# EAGLE schematic obc (EAGLE 9.4.2)

## Sheet 1 of 8: MCU
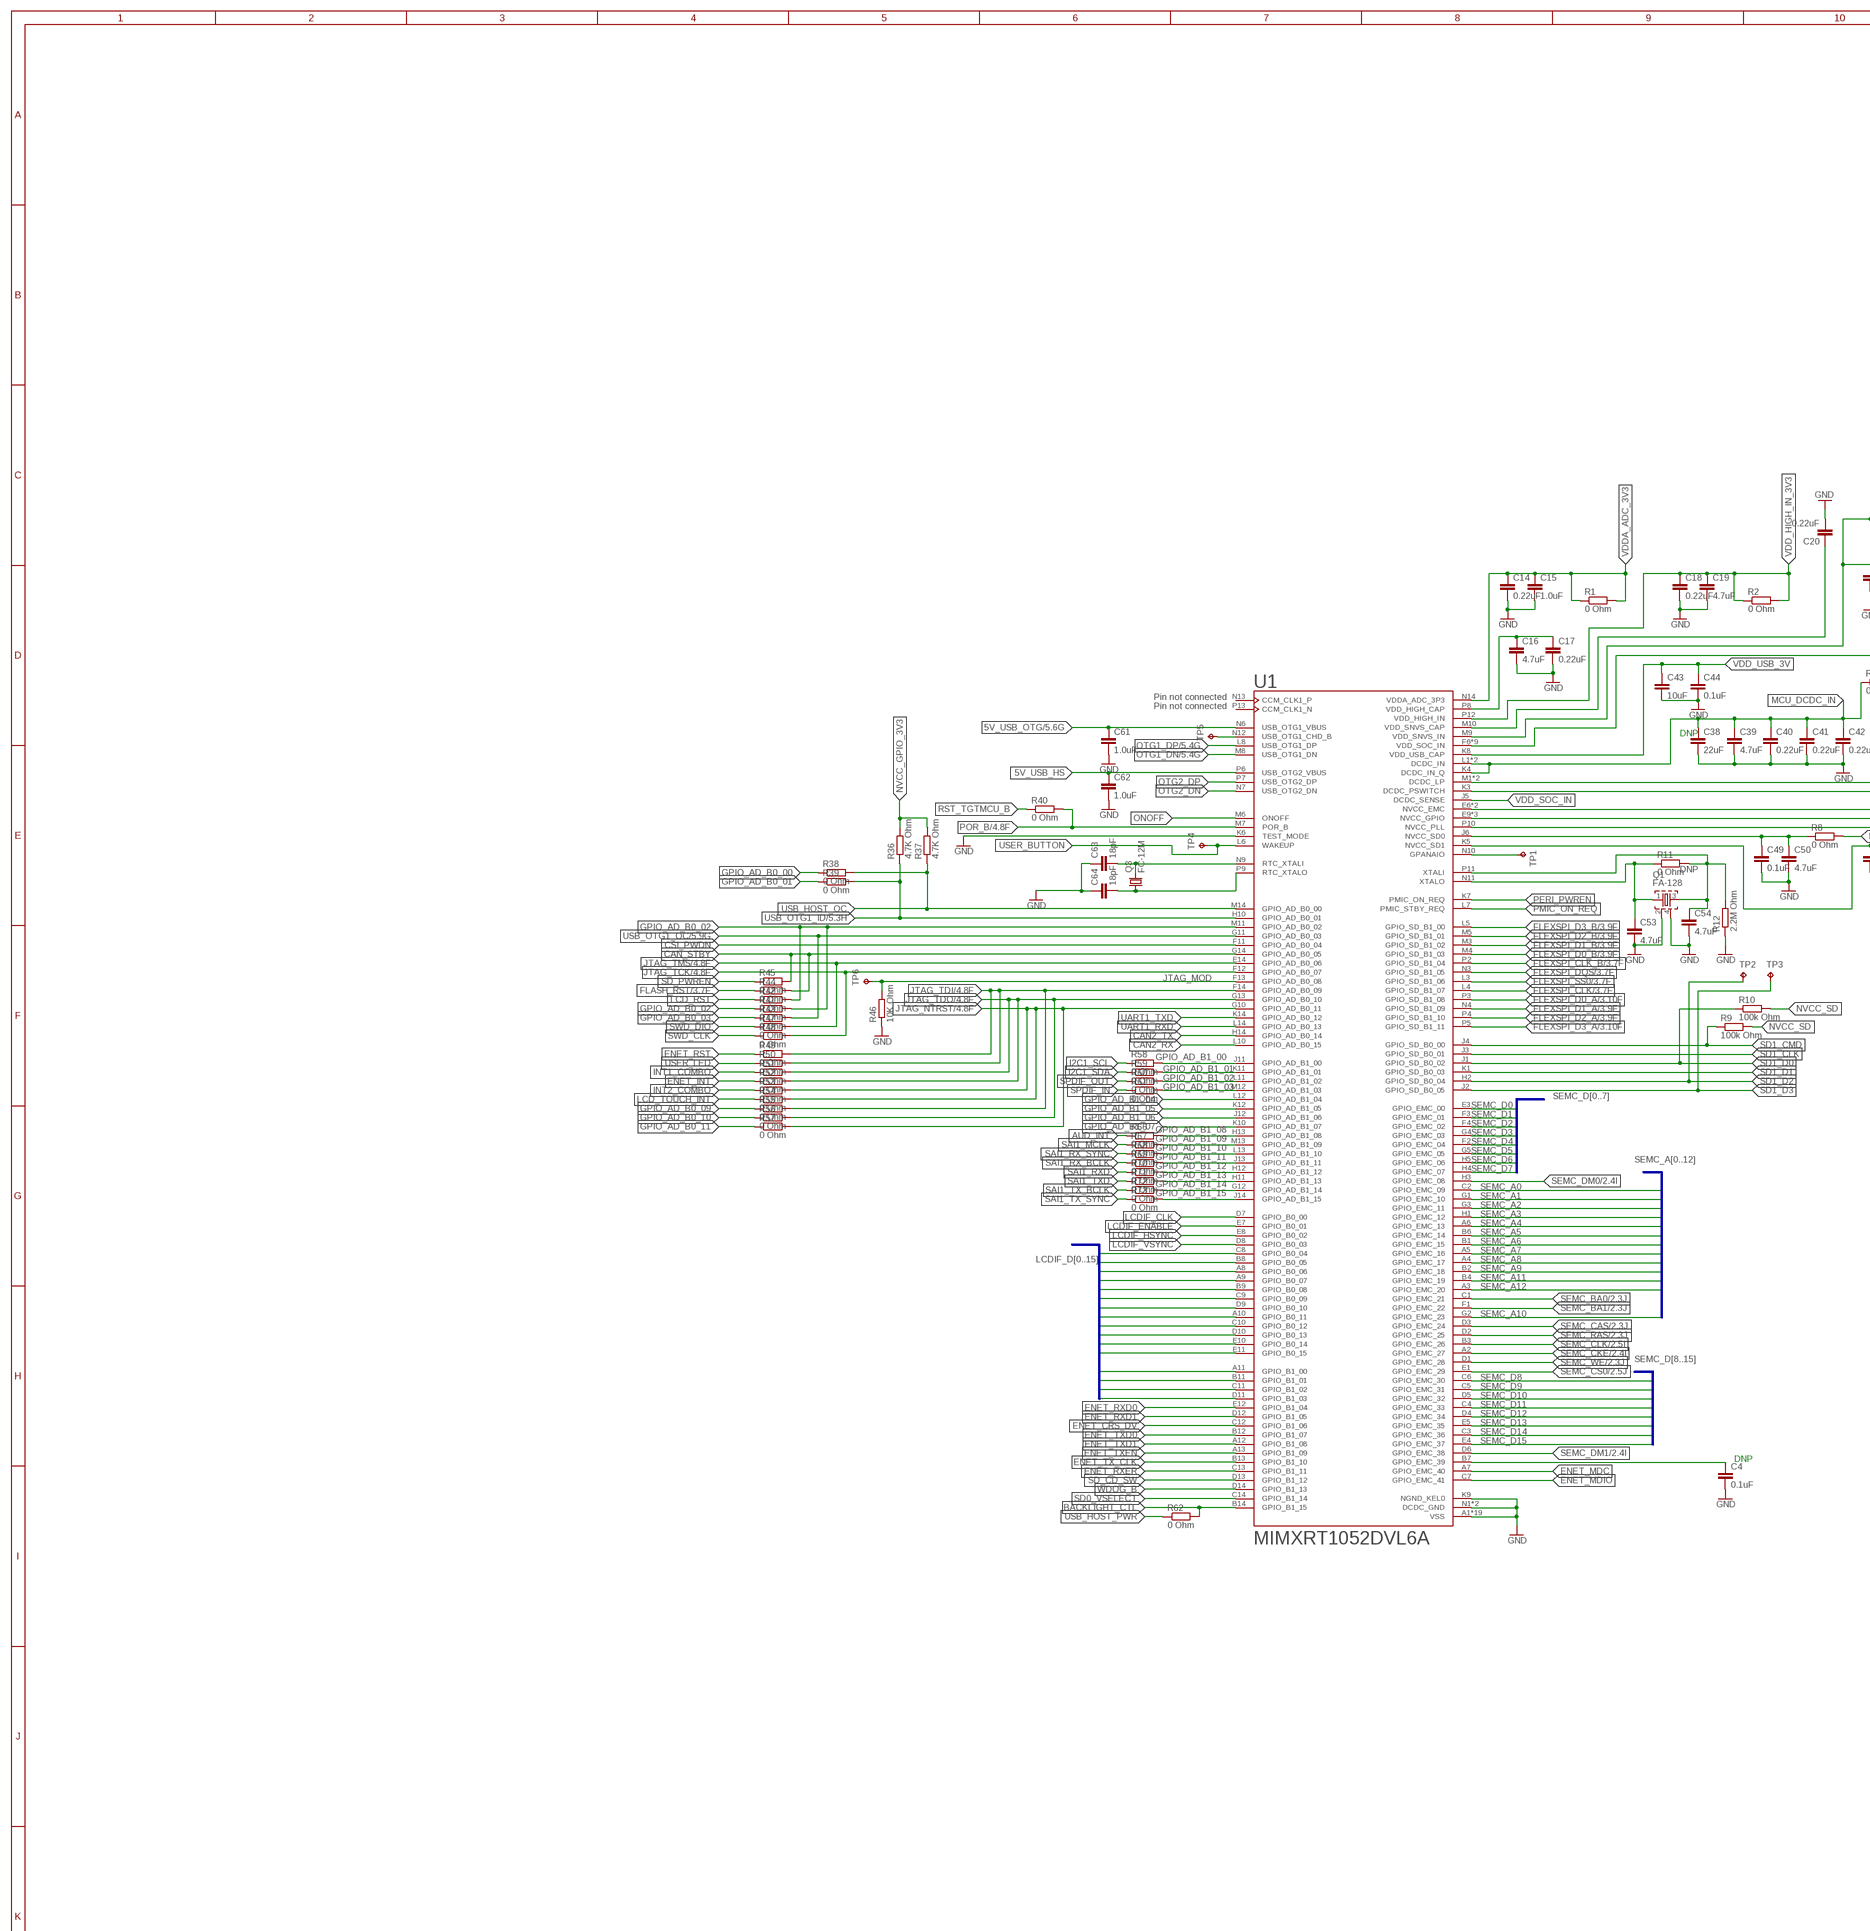
[diagram p0: schematic, sheet 1, part 1 of 3]
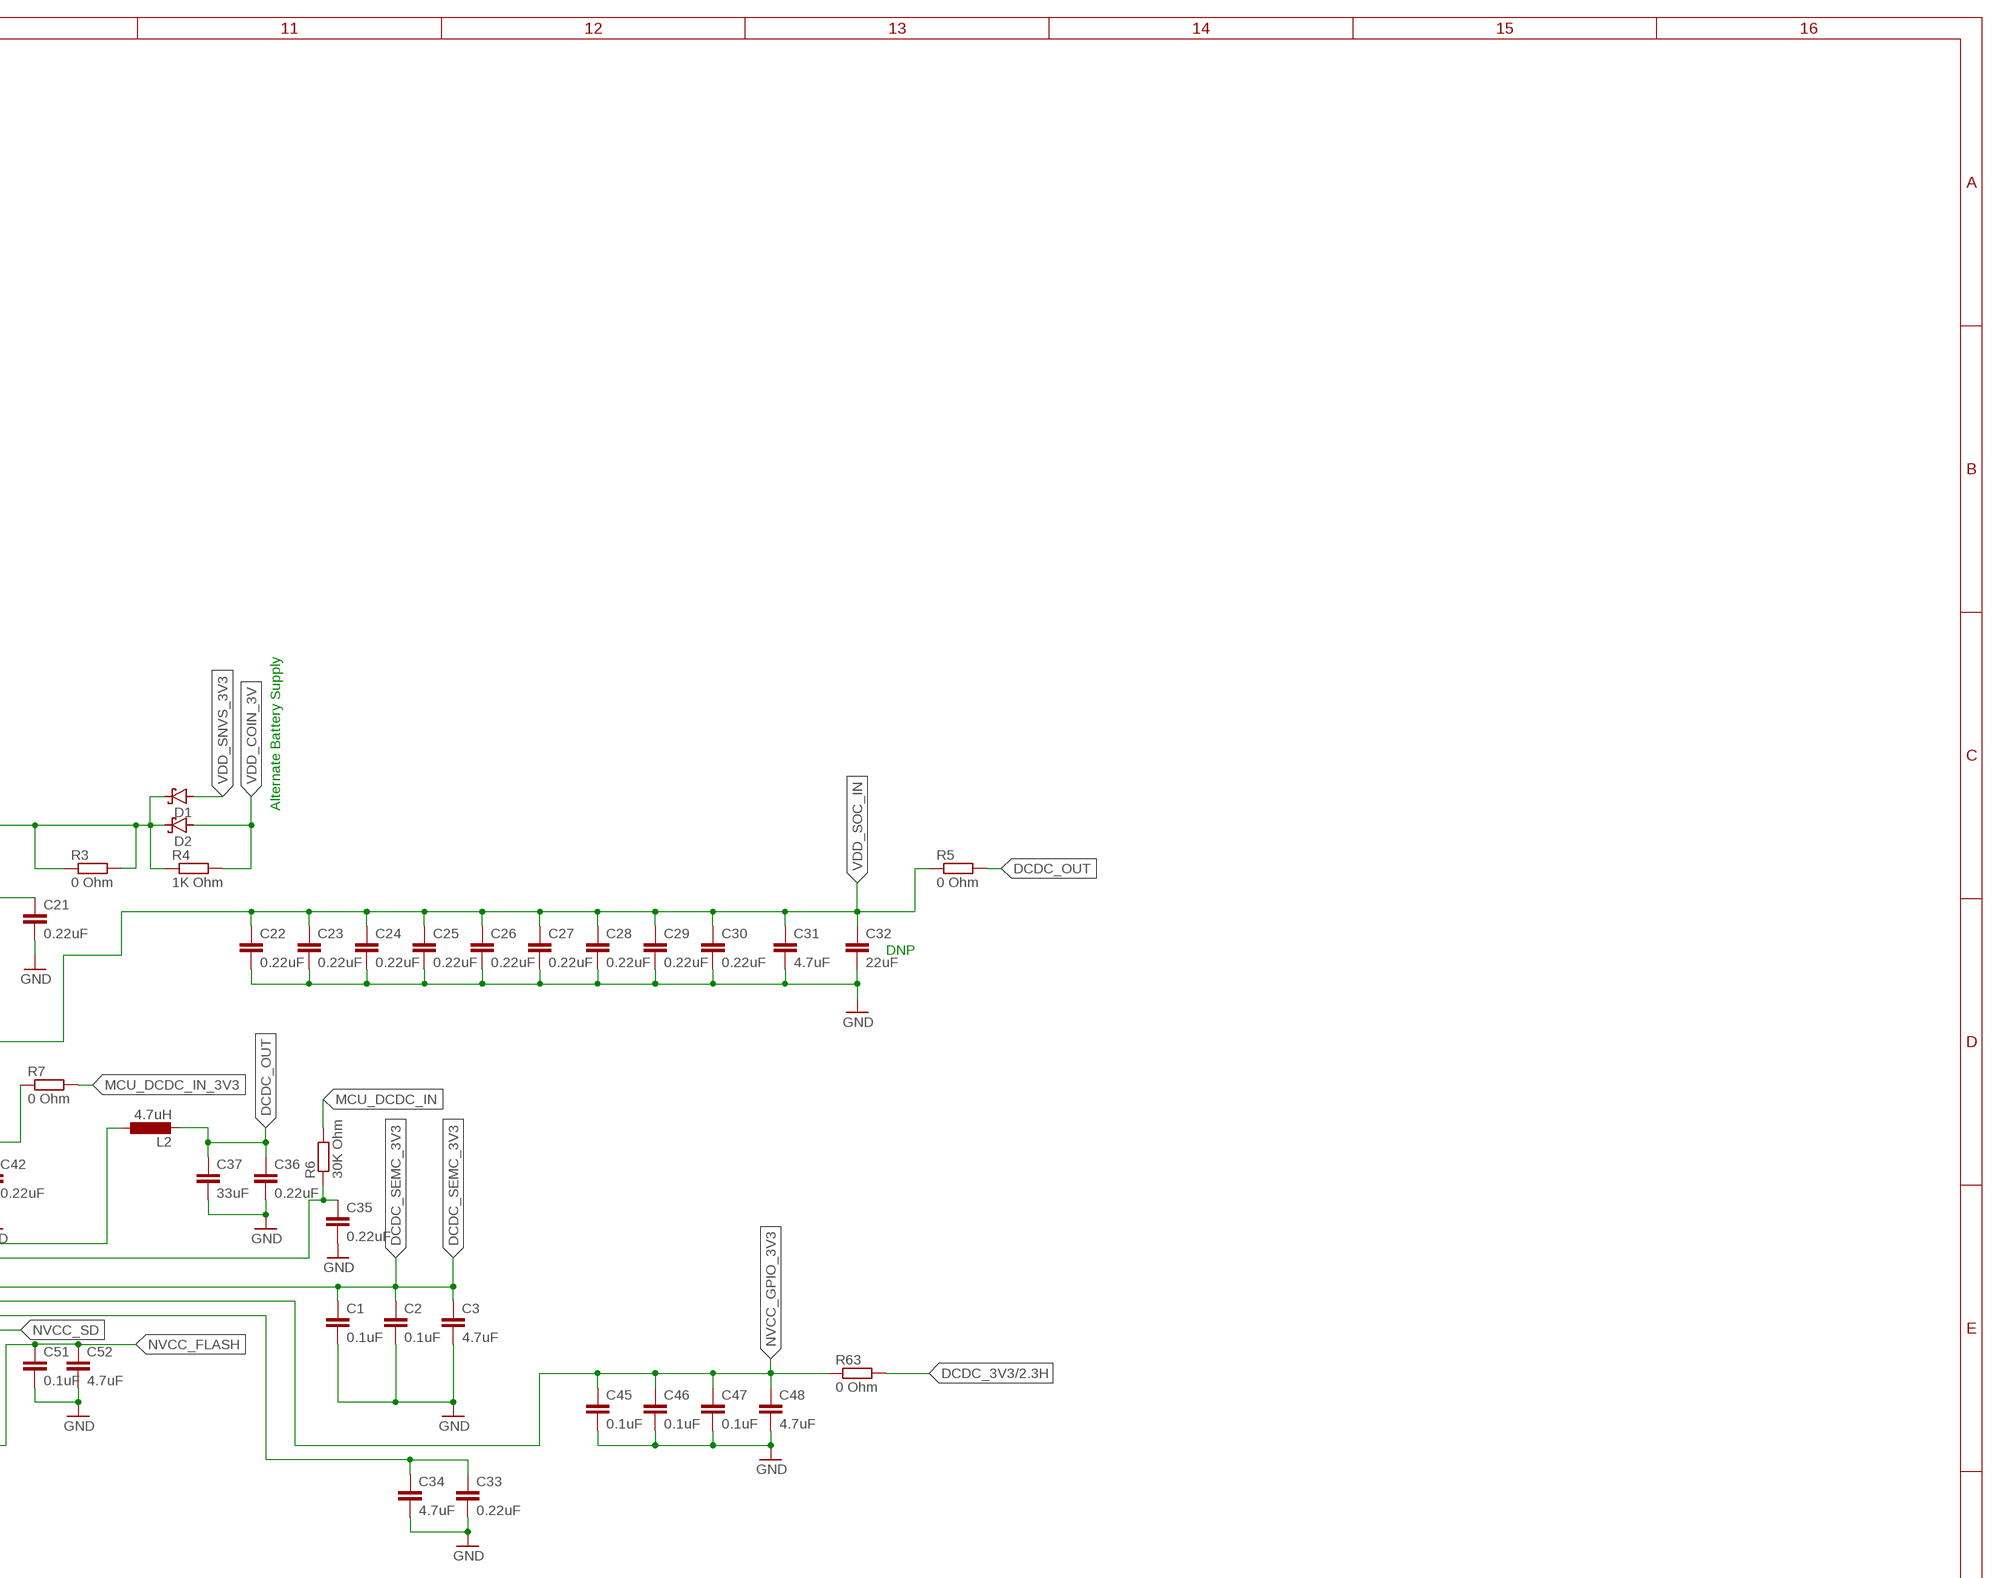
[diagram p1: schematic, sheet 1, part 2 of 3]
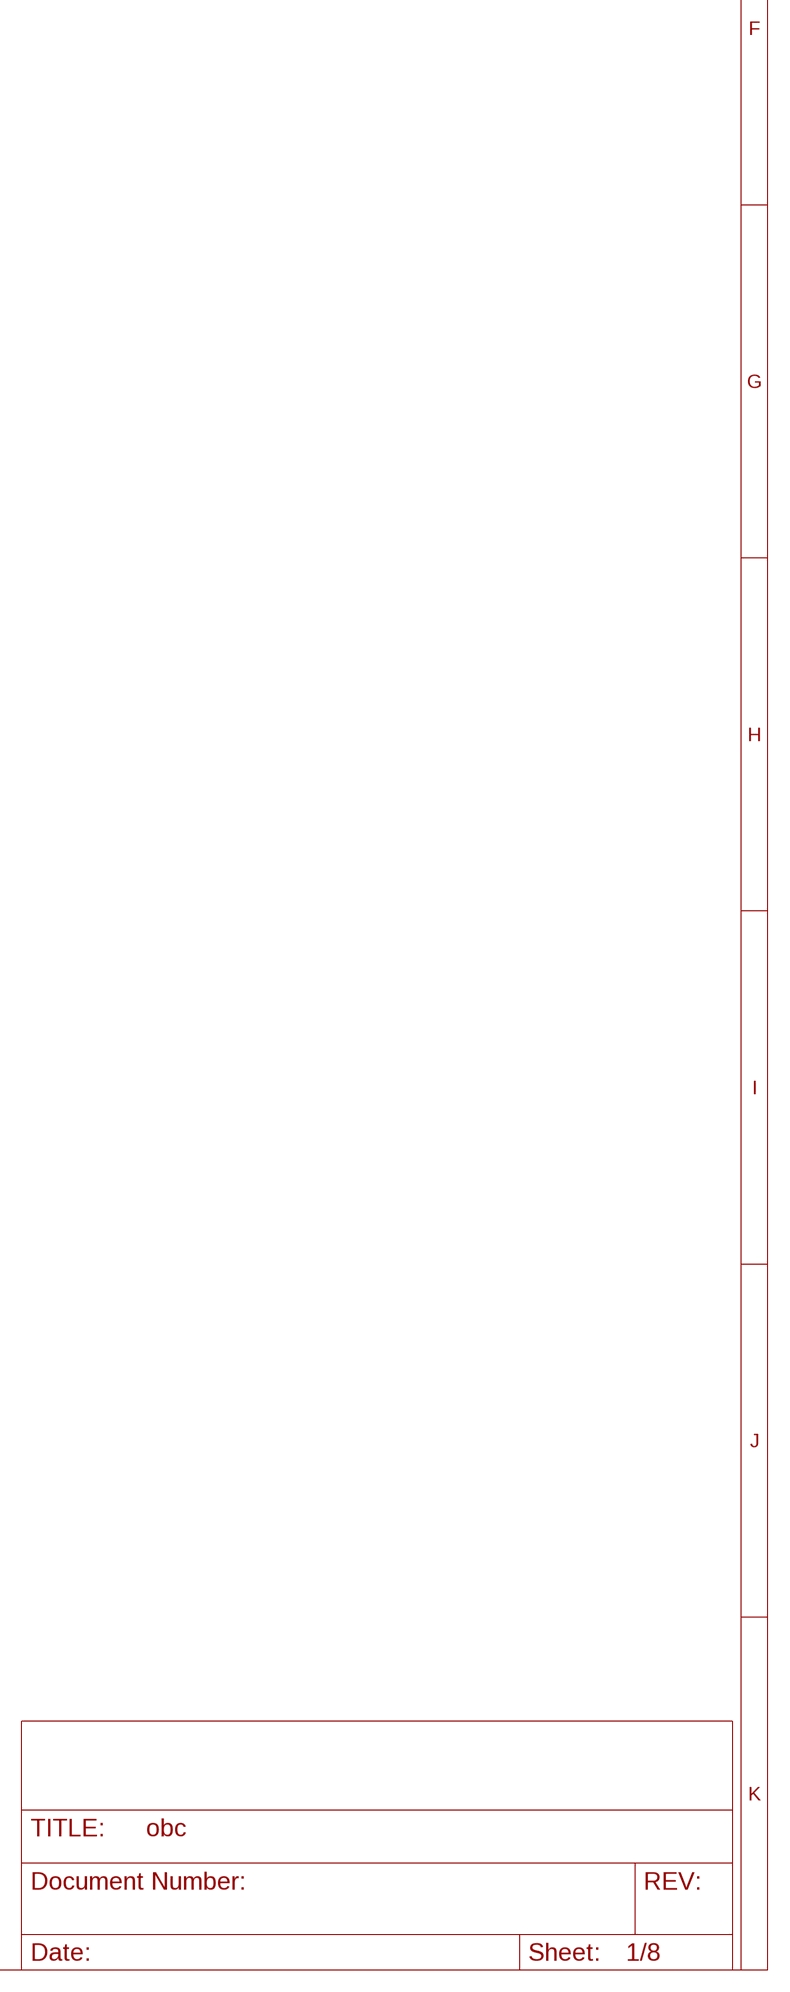
[diagram p2: schematic, sheet 1, part 3 of 3]

### Parts
C1  0.1uF  C-EUC0402K  [C0402K]
C2  0.1uF  C-EUC0402K  [C0402K]
C3  4.7uF  C-EUC0402K  [C0402K]
C4  0.1uF  C-EUC0402K  [C0402K]
C14  0.22uF  C-EUC0402K  [C0402K]
C15  1.0uF  C-EUC0402K  [C0402K]
C16  4.7uF  C-EUC0402K  [C0402K]
C17  0.22uF  C-EUC0402K  [C0402K]
C18  0.22uF  C-EUC0402K  [C0402K]
C19  4.7uF  C-EUC0402K  [C0402K]
C20  0.22uF  C-EUC0402K  [C0402K]
C21  0.22uF  C-EUC0402K  [C0402K]
C22  0.22uF  C-EUC0402K  [C0402K]
C23  0.22uF  C-EUC0402K  [C0402K]
C24  0.22uF  C-EUC0402K  [C0402K]
C25  0.22uF  C-EUC0402K  [C0402K]
C26  0.22uF  C-EUC0402K  [C0402K]
C27  0.22uF  C-EUC0402K  [C0402K]
C28  0.22uF  C-EUC0402K  [C0402K]
C29  0.22uF  C-EUC0402K  [C0402K]
C30  0.22uF  C-EUC0402K  [C0402K]
C31  4.7uF  C-EUC0402K  [C0402K]
C32  22uF  C-EUC0603K  [C0603K]
C33  0.22uF  C-EUC0402K  [C0402K]
C34  4.7uF  C-EUC0402K  [C0402K]
C35  0.22uF  C-EUC0402K  [C0402K]
C36  0.22uF  C-EUC0402K  [C0402K]
C37  33uF  C-EUC0402K  [C0402K]
C38  22uF  C-EUC0402K  [C0402K]
C39  4.7uF  C-EUC0402K  [C0402K]
C40  0.22uF  C-EUC0402K  [C0402K]
C41  0.22uF  C-EUC0402K  [C0402K]
C42  0.22uF  C-EUC0402K  [C0402K]
C43  10uF  C-EUC0402K  [C0402K]
C44  0.1uF  C-EUC0402K  [C0402K]
C45  0.1uF  C-EUC0402K  [C0402K]
C46  0.1uF  C-EUC0402K  [C0402K]
C47  0.1uF  C-EUC0402K  [C0402K]
C48  4.7uF  C-EUC0402K  [C0402K]
C49  0.1uF  C-EUC0402K  [C0402K]
C50  4.7uF  C-EUC0402K  [C0402K]
C51  0.1uF  C-EUC0402K  [C0402K]
C52  4.7uF  C-EUC0402K  [C0402K]
C53  4.7uF  C-EUC0402K  [C0402K]
C54  4.7uF  C-EUC0402K  [C0402K]
C61  1.0uF  C-EUC0402K  [C0402K]
C62  1.0uF  C-EUC0402K  [C0402K]
C63  18pF  C-EUC0402K  [C0402K]
C64  18pF  C-EUC0402K  [C0402K]
D1  SCHOTTKY-DIODESMC  [SMC]
D2  SCHOTTKY-DIODESMC  [SMC]
L2  4.7uH  L-EUL4035M  [L4035M]
Q1  FA-128  [FA-128]
Q3  FC-12M  [FC-12M]
R1  0 Ohm  R-EU_R0402  [R0402]
R2  0 Ohm  R-EU_R0402  [R0402]
R3  0 Ohm  R-EU_R0402  [R0402]
R4  1K Ohm  R-EU_R0402  [R0402]
R5  0 Ohm  R-EU_R0402  [R0402]
R6  30K Ohm  R-EU_R0402  [R0402]
R7  0 Ohm  R-EU_R0402  [R0402]
R8  0 Ohm  R-EU_R0402  [R0402]
R9  100k Ohm  R-EU_R0402  [R0402]
R10  100k Ohm  R-EU_R0402  [R0402]
R11  0 Ohm  R-EU_R0402  [R0402]
R12  2.2M Ohm  R-EU_R0402  [R0402]
R36  4.7K Ohm  R-EU_R0402  [R0402]
R37  4.7K Ohm  R-EU_R0402  [R0402]
R38  0 Ohm  R-EU_R0402  [R0402]
R39  0 Ohm  R-EU_R0402  [R0402]
R40  0 Ohm  R-EU_R0402  [R0402]
R41  0 Ohm  R-EU_R0402  [R0402]
R42  0 Ohm  R-EU_R0402  [R0402]
R43  0 Ohm  R-EU_R0402  [R0402]
R44  0 Ohm  R-EU_R0402  [R0402]
R45  0 Ohm  R-EU_R0402  [R0402]
R46  10K Ohm  R-EU_R0402  [R0402]
R47  0 Ohm  R-EU_R0402  [R0402]
R48  0 Ohm  R-EU_R0402  [R0402]
R49  0 Ohm  R-EU_R0402  [R0402]
R50  0 Ohm  R-EU_R0402  [R0402]
R51  0 Ohm  R-EU_R0402  [R0402]
R52  0 Ohm  R-EU_R0402  [R0402]
R53  0 Ohm  R-EU_R0402  [R0402]
R54  0 Ohm  R-EU_R0402  [R0402]
R55  0 Ohm  R-EU_R0402  [R0402]
R56  0 Ohm  R-EU_R0402  [R0402]
R57  0 Ohm  R-EU_R0402  [R0402]
R58  0 Ohm  R-EU_R0402  [R0402]
R59  0 Ohm  R-EU_R0402  [R0402]
R60  0 Ohm  R-EU_R0402  [R0402]
R61  0 Ohm  R-EU_R0402  [R0402]
R62  0 Ohm  R-EU_R0402  [R0402]
R63  0 Ohm  R-EU_R0402  [R0402]
R66  0 Ohm  R-EU_R0402  [R0402]
R67  0 Ohm  R-EU_R0402  [R0402]
R68  0 Ohm  R-EU_R0402  [R0402]
R69  0 Ohm  R-EU_R0402  [R0402]
R70  0 Ohm  R-EU_R0402  [R0402]
R71  0 Ohm  R-EU_R0402  [R0402]
R72  0 Ohm  R-EU_R0402  [R0402]
R73  0 Ohm  R-EU_R0402  [R0402]
TP1  TPTP06R  [TP06R]
TP2  TPTP06R  [TP06R]
TP3  TPTP06R  [TP06R]
TP4  TPTP06R  [TP06R]
TP5  TPTP06R  [TP06R]
TP6  TPTP06R  [TP06R]
U1  MIMXRT1052DVL6A  [BGA196C65P14X14_1000X1000X152N]

### Nets
5V_USB_HS: C62.1 U1.P6(USB_OTG2_VBUS)
5V_USB_OTG: C61.1 U1.N6(USB_OTG1_VBUS) ; also sheet 5
AUD_INT: R66.1
BACKLIGHT_CTL: R62.2 U1.B14(GPIO_B1_15)
CAN2_RX: U1.L10(GPIO_AD_B0_15)
CAN2_TX: U1.H14(GPIO_AD_B0_14)
CAN_STBY: R44.2 R45.2 U1.G14(GPIO_AD_B0_05)
CSI_PWDN: U1.F11(GPIO_AD_B0_04)
DCDC_3V3: R63.2 ; also sheet 2,4,5
DCDC_OUT: C36.1 C37.1 L2.2 R5.2
DCDC_SEMC_3V3: C1.1 C2.1 C3.1 U1.E6(NVCC_EMC) U1.F5(NVCC_EMC)
ENET_CRS_DV: U1.C12(GPIO_B1_06)
ENET_INT: R52.1
ENET_MDC: U1.A7(GPIO_EMC_40)
ENET_MDIO: U1.C7(GPIO_EMC_41)
ENET_RST: R49.1
ENET_RXD0: U1.E12(GPIO_B1_04)
ENET_RXD1: U1.D12(GPIO_B1_05)
ENET_RXER: U1.C13(GPIO_B1_11)
ENET_TX_CLK: U1.B13(GPIO_B1_10)
ENET_TXD0: U1.B12(GPIO_B1_07)
ENET_TXD1: U1.A12(GPIO_B1_08)
ENET_TXEN: U1.A13(GPIO_B1_09)
FLASH_RST: R44.1 ; also sheet 3
FLEXSPI_CLK: U1.L4(GPIO_SD_B1_07) ; also sheet 3
FLEXSPI_CLK_B: U1.P2(GPIO_SD_B1_04) ; also sheet 3
FLEXSPI_D0_A: U1.P3(GPIO_SD_B1_08) ; also sheet 3
FLEXSPI_D0_B: U1.M4(GPIO_SD_B1_03) ; also sheet 3
FLEXSPI_D1_A: U1.N4(GPIO_SD_B1_09) ; also sheet 3
FLEXSPI_D1_B: U1.M3(GPIO_SD_B1_02) ; also sheet 3
FLEXSPI_D2_A: U1.P4(GPIO_SD_B1_10) ; also sheet 3
FLEXSPI_D2_B: U1.M5(GPIO_SD_B1_01) ; also sheet 3
FLEXSPI_D3_A: U1.P5(GPIO_SD_B1_11) ; also sheet 3
FLEXSPI_D3_B: U1.L5(GPIO_SD_B1_00) ; also sheet 3
FLEXSPI_DQS: U1.N3(GPIO_SD_B1_05) ; also sheet 3
FLEXSPI_SS0: U1.L3(GPIO_SD_B1_06) ; also sheet 3
GND: C1.2 C2.2 C3.2 C4.2 C14.2 C15.2 C16.2 C17.2 C18.2 C19.2 C20.2 C21.2 C22.2 C23.2 C24.2 C25.2 C26.2 C27.2 C28.2 C29.2 C30.2 C31.2 C32.2 C33.2 C34.2 C35.2 C36.2 C37.2 C38.2 C39.2 C40.2 C41.2 C42.2 C43.2 C44.2 C45.2 C46.2 C47.2 C48.2 C49.2 C50.2 C51.2 C52.2 C53.2 C54.2 C61.2 C62.2 C63.1 C64.1 Q1.2 Q1.4 R12.1 R46.1 U1.A1(VSS) U1.A14(VSS) U1.B5(VSS) U1.B10(VSS) U1.E2(VSS) U1.E13(VSS) U1.G7(VSS) U1.G8(VSS) U1.H7(VSS) U1.H8(VSS) U1.J7(VSS) U1.J8(VSS) U1.K2(VSS) U1.K6(TEST_MODE) U1.K9(NGND_KEL0) U1.K13(VSS) U1.L9(VSS) U1.N1(DCDC_GND) U1.N2(DCDC_GND) U1.N5(VSS) U1.N8(VSS) U1.P1(VSS) U1.P14(VSS) ; also sheet 2,3,4,5,6
GPIO_AD_B0_00: R38.1
GPIO_AD_B0_01: R39.1
GPIO_AD_B0_02: R41.1 R41.2 R42.2 U1.M11(GPIO_AD_B0_02)
GPIO_AD_B0_03: R43.1
GPIO_AD_B0_09: R55.1
GPIO_AD_B0_10: R56.1
GPIO_AD_B0_11: R57.1
GPIO_AD_B1_00: R58.2 U1.J11(GPIO_AD_B1_00)
GPIO_AD_B1_01: R59.2 U1.K11(GPIO_AD_B1_01)
GPIO_AD_B1_02: R60.2 U1.L11(GPIO_AD_B1_02)
GPIO_AD_B1_03: R61.2 U1.M12(GPIO_AD_B1_03)
GPIO_AD_B1_04: U1.L12(GPIO_AD_B1_04)
GPIO_AD_B1_05: U1.K12(GPIO_AD_B1_05)
GPIO_AD_B1_06: U1.J12(GPIO_AD_B1_06)
GPIO_AD_B1_07: U1.K10(GPIO_AD_B1_07)
GPIO_AD_B1_08: R66.2 U1.H13(GPIO_AD_B1_08)
GPIO_AD_B1_09: R67.2 U1.M13(GPIO_AD_B1_09)
GPIO_AD_B1_10: R68.2 U1.L13(GPIO_AD_B1_10)
GPIO_AD_B1_11: R69.2 U1.J13(GPIO_AD_B1_11)
GPIO_AD_B1_12: R70.2 U1.H12(GPIO_AD_B1_12)
GPIO_AD_B1_13: R71.2 U1.H11(GPIO_AD_B1_13)
GPIO_AD_B1_14: R72.2 U1.G12(GPIO_AD_B1_14)
GPIO_AD_B1_15: R73.2 U1.J14(GPIO_AD_B1_15)
I2C1_SCL: R58.1
I2C1_SDA: R59.1
INT1_COMBO: R51.1
INT2_COMBO: R53.1
JTAG_MOD: R46.2 TP6.TP U1.F13(GPIO_AD_B0_08)
JTAG_NTRST: R53.2 R54.2 R57.2 U1.G10(GPIO_AD_B0_11) ; also sheet 4
JTAG_TCK: R48.2 U1.F12(GPIO_AD_B0_07) ; also sheet 4
JTAG_TDI: R49.2 R50.2 R55.2 U1.F14(GPIO_AD_B0_09) ; also sheet 4
JTAG_TDO: R51.2 R52.2 R56.2 U1.G13(GPIO_AD_B0_10) ; also sheet 4
JTAG_TMS: R47.2 U1.E14(GPIO_AD_B0_06) ; also sheet 4
LCD_RST: R42.1
LCD_TOUCH_INT: R54.1
LCDIF_CLK: U1.D7(GPIO_B0_00)
LCDIF_D0: U1.C8(GPIO_B0_04)
LCDIF_D1: U1.B8(GPIO_B0_05)
LCDIF_D2: U1.A8(GPIO_B0_06)
LCDIF_D3: U1.A9(GPIO_B0_07)
LCDIF_D4: U1.B9(GPIO_B0_08)
LCDIF_D5: U1.C9(GPIO_B0_09)
LCDIF_D6: U1.D9(GPIO_B0_10)
LCDIF_D7: U1.A10(GPIO_B0_11)
LCDIF_D8: U1.C10(GPIO_B0_12)
LCDIF_D9: U1.D10(GPIO_B0_13)
LCDIF_D10: U1.E10(GPIO_B0_14)
LCDIF_D11: U1.E11(GPIO_B0_15)
LCDIF_D12: U1.A11(GPIO_B1_00)
LCDIF_D13: U1.B11(GPIO_B1_01)
LCDIF_D14: U1.C11(GPIO_B1_02)
LCDIF_D15: U1.D11(GPIO_B1_03)
LCDIF_ENABLE: U1.E7(GPIO_B0_01)
LCDIF_HSYNC: U1.E8(GPIO_B0_02)
LCDIF_VSYNC: U1.D8(GPIO_B0_03)
MCU_DCDC_IN: C38.1 C39.1 C40.1 C41.1 C42.1 R6.2 R7.1 U1.K4(DCDC_IN_Q) U1.L1(DCDC_IN) U1.L2(DCDC_IN)
MCU_DCDC_IN_3V3: R7.2
N$1: C4.1 U1.B7(GPIO_EMC_39)
N$2: C16.1 C17.1 U1.P8(VDD_HIGH_CAP)
N$3: C20.1 U1.M10(VDD_SNVS_CAP)
N$4: C35.1 R6.1 U1.K3(DCDC_PSWITCH)
N$5: C21.1 D1.C D2.C R3.1 R3.2 R4.1 U1.M9(VDD_SNVS_IN)
N$6: L2.1 U1.M1(DCDC_LP) U1.M2(DCDC_LP)
N$7: C33.1 C34.1 U1.P10(NVCC_PLL)
N$8: C49.1 C50.1 R8.1 U1.J6(NVCC_SD0)
N$9: TP1.TP U1.N10(GPANAIO)
N$10: C54.1 Q1.3 R11.2 R12.2 U1.P11(XTALI)
N$11: C53.1 Q1.1 R11.1 U1.N11(XTALO)
N$52: TP5.TP U1.N12(USB_OTG1_CHD_B)
N$53: C63.2 Q3.2 U1.N9(RTC_XTALI)
N$55: C64.2 Q3.1 U1.P9(RTC_XTALO)
NVCC_FLASH: C51.1 C52.1 U1.K5(NVCC_SD1)
NVCC_GPIO_3V3: C45.1 C46.1 C47.1 C48.1 R36.2 R37.2 R63.1 U1.E9(NVCC_GPIO) U1.F10(NVCC_GPIO) U1.J10(NVCC_GPIO)
NVCC_SD: R8.2 R9.2 R10.2
ONOFF: U1.M6(ONOFF)
OTG1_DN: U1.M8(USB_OTG1_DN) ; also sheet 5
OTG1_DP: U1.L8(USB_OTG1_DP) ; also sheet 5
OTG2_DN: U1.N7(USB_OTG2_DN)
OTG2_DP: U1.P7(USB_OTG2_DP)
PERI_PWREN: U1.K7(PMIC_ON_REQ)
PMIC_ON_REQ: U1.L7(PMIC_STBY_REQ)
POR_B: R40.2 U1.M7(POR_B) ; also sheet 4
RST_TGTMCU_B: R40.1
SAI1_MCLK: R67.1
SAI1_RX_BCLK: R69.1
SAI1_RX_SYNC: R68.1
SAI1_RXD: R70.1
SAI1_TX_BCLK: R72.1
SAI1_TX_SYNC: R73.1
SAI1_TXD: R71.1
SD0_VSELECT: U1.C14(GPIO_B1_14)
SD1_CLK: U1.J3(GPIO_SD_B0_01)
SD1_CMD: R9.1 U1.J4(GPIO_SD_B0_00)
SD1_D0: R10.1 U1.J1(GPIO_SD_B0_02)
SD1_D1: U1.K1(GPIO_SD_B0_03)
SD1_D2: TP2.TP U1.H2(GPIO_SD_B0_04)
SD1_D3: TP3.TP U1.J2(GPIO_SD_B0_05)
SD_CD_SW: U1.D13(GPIO_B1_12)
SD_PWREN: R45.1
SEMC_A0: U1.C2(GPIO_EMC_09) ; also sheet 2
SEMC_A1: U1.G1(GPIO_EMC_10) ; also sheet 2
SEMC_A2: U1.G3(GPIO_EMC_11) ; also sheet 2
SEMC_A3: U1.H1(GPIO_EMC_12) ; also sheet 2
SEMC_A4: U1.A6(GPIO_EMC_13) ; also sheet 2
SEMC_A5: U1.B6(GPIO_EMC_14) ; also sheet 2
SEMC_A6: U1.B1(GPIO_EMC_15) ; also sheet 2
SEMC_A7: U1.A5(GPIO_EMC_16) ; also sheet 2
SEMC_A8: U1.A4(GPIO_EMC_17) ; also sheet 2
SEMC_A9: U1.B2(GPIO_EMC_18) ; also sheet 2
SEMC_A10: U1.G2(GPIO_EMC_23) ; also sheet 2
SEMC_A11: U1.B4(GPIO_EMC_19) ; also sheet 2
SEMC_A12: U1.A3(GPIO_EMC_20) ; also sheet 2
SEMC_BA0: U1.C1(GPIO_EMC_21) ; also sheet 2
SEMC_BA1: U1.F1(GPIO_EMC_22) ; also sheet 2
SEMC_CAS: U1.D3(GPIO_EMC_24) ; also sheet 2
SEMC_CKE: U1.A2(GPIO_EMC_27) ; also sheet 2
SEMC_CLK: U1.B3(GPIO_EMC_26) ; also sheet 2
SEMC_CS0: U1.E1(GPIO_EMC_29) ; also sheet 2
SEMC_D0: U1.E3(GPIO_EMC_00) ; also sheet 2
SEMC_D1: U1.F3(GPIO_EMC_01) ; also sheet 2
SEMC_D2: U1.F4(GPIO_EMC_02) ; also sheet 2
SEMC_D3: U1.G4(GPIO_EMC_03) ; also sheet 2
SEMC_D4: U1.F2(GPIO_EMC_04) ; also sheet 2
SEMC_D5: U1.G5(GPIO_EMC_05) ; also sheet 2
SEMC_D6: U1.H5(GPIO_EMC_06) ; also sheet 2
SEMC_D7: U1.H4(GPIO_EMC_07) ; also sheet 2
SEMC_D8: U1.C6(GPIO_EMC_30) ; also sheet 2
SEMC_D9: U1.C5(GPIO_EMC_31) ; also sheet 2
SEMC_D10: U1.D5(GPIO_EMC_32) ; also sheet 2
SEMC_D11: U1.C4(GPIO_EMC_33) ; also sheet 2
SEMC_D12: U1.D4(GPIO_EMC_34) ; also sheet 2
SEMC_D13: U1.E5(GPIO_EMC_35) ; also sheet 2
SEMC_D14: U1.C3(GPIO_EMC_36) ; also sheet 2
SEMC_D15: U1.E4(GPIO_EMC_37) ; also sheet 2
SEMC_DM0: U1.H3(GPIO_EMC_08) ; also sheet 2
SEMC_DM1: U1.D6(GPIO_EMC_38) ; also sheet 2
SEMC_RAS: U1.D2(GPIO_EMC_25) ; also sheet 2
SEMC_WE: U1.D1(GPIO_EMC_28) ; also sheet 2
SPDIF_IN: R61.1
SPDIF_OUT: R60.1
SWD_CLK: R48.1
SWD_DIO: R47.1
UART1_RXD: U1.L14(GPIO_AD_B0_13)
UART1_TXD: U1.K14(GPIO_AD_B0_12)
USB_HOST_OC: R37.1 R38.2 U1.M14(GPIO_AD_B0_00)
USB_HOST_PWR: R62.1
USB_OTG1_ID: R36.1 R39.2 U1.H10(GPIO_AD_B0_01) ; also sheet 5
USB_OTG1_OC: R43.2 U1.G11(GPIO_AD_B0_03) ; also sheet 5
USER_BUTTON: TP4.TP U1.L6(WAKEUP)
USER_LED: R50.1
VDD_COIN_3V: D2.A R4.2
VDD_HIGH_IN_3V3: C18.1 C19.1 R2.1 R2.2 U1.P12(VDD_HIGH_IN)
VDD_SNVS_3V3: D1.A
VDD_SOC_IN: C22.1 C23.1 C24.1 C25.1 C26.1 C27.1 C28.1 C29.1 C30.1 C31.1 C32.1 R5.1 U1.F6(VDD_SOC_IN) U1.F7(VDD_SOC_IN) U1.F8(VDD_SOC_IN) U1.F9(VDD_SOC_IN) U1.G6(VDD_SOC_IN) U1.G9(VDD_SOC_IN) U1.H6(VDD_SOC_IN) U1.H9(VDD_SOC_IN) U1.J5(DCDC_SENSE) U1.J9(VDD_SOC_IN)
VDD_USB_3V: C43.1 C44.1 U1.K8(VDD_USB_CAP)
VDDA_ADC_3V3: C14.1 C15.1 R1.1 R1.2 U1.N14(VDDA_ADC_3P3)
WDOG_B: U1.D14(GPIO_B1_13)
Unconnected: U1.N13(CCM_CLK1_P) U1.P13(CCM_CLK1_N)

### Buses
SEMC_D[0..7]
SEMC_A[0..12]
SEMC_D[8..15]
LCDIF_D[0..15]

### Notes on the sheet
- Alternate Battery Supply
- DNP
- Pin not connected
- Pin not connected
- DNP
- DNP
- DNP

## Sheet 2 of 8: SDRAM
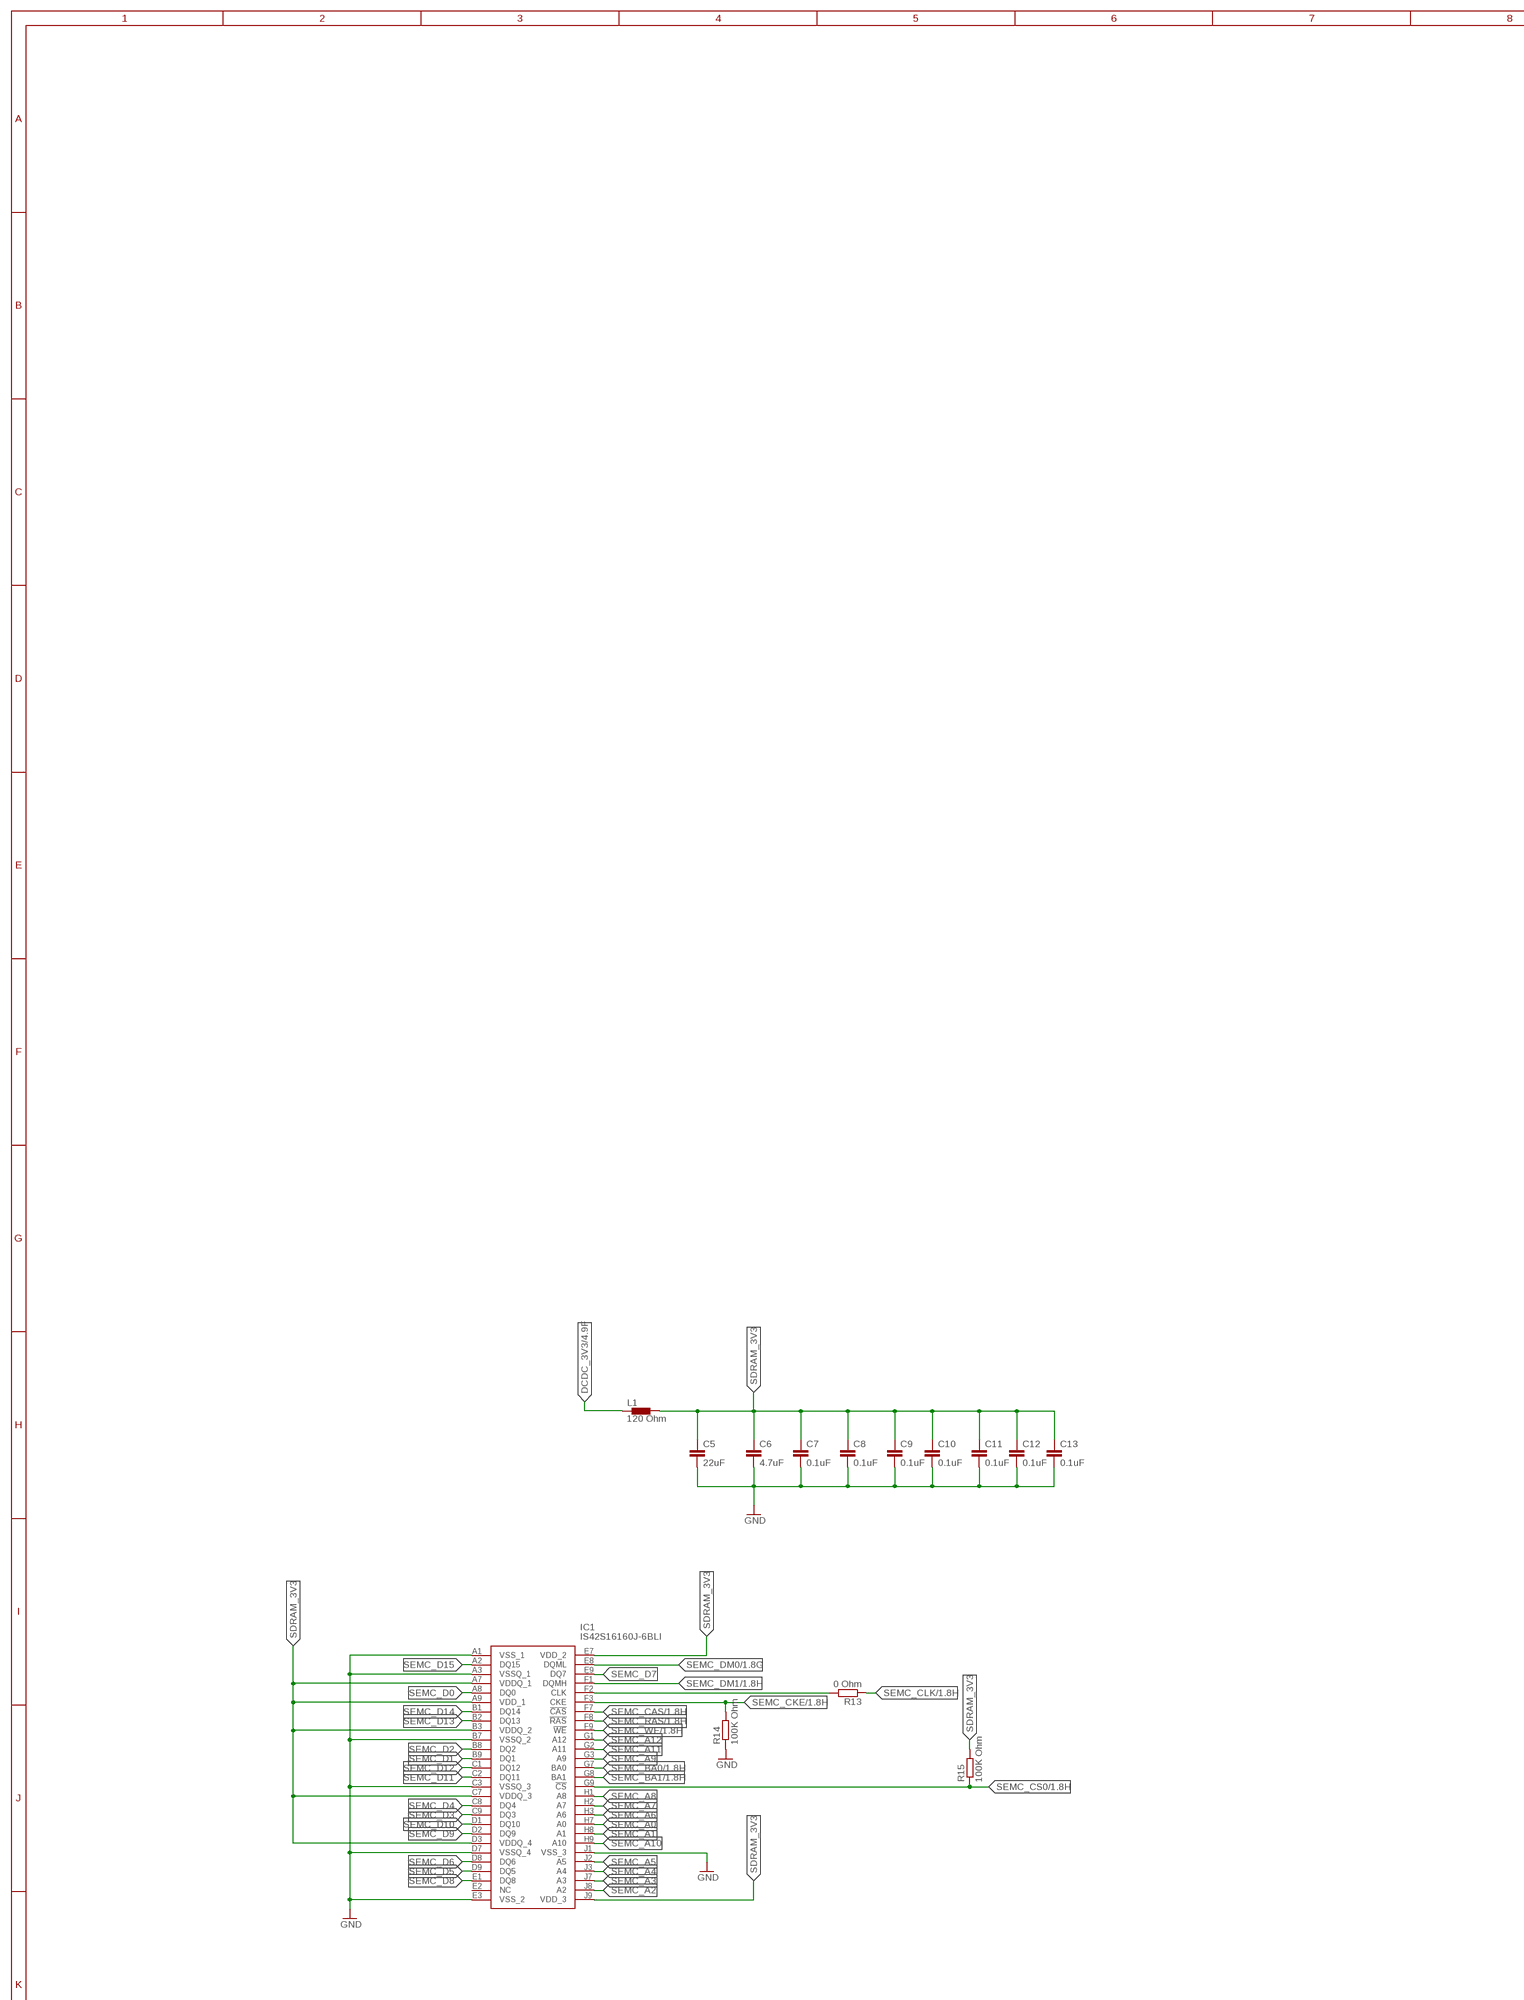
[diagram p3: schematic, sheet 2, part 1 of 3]
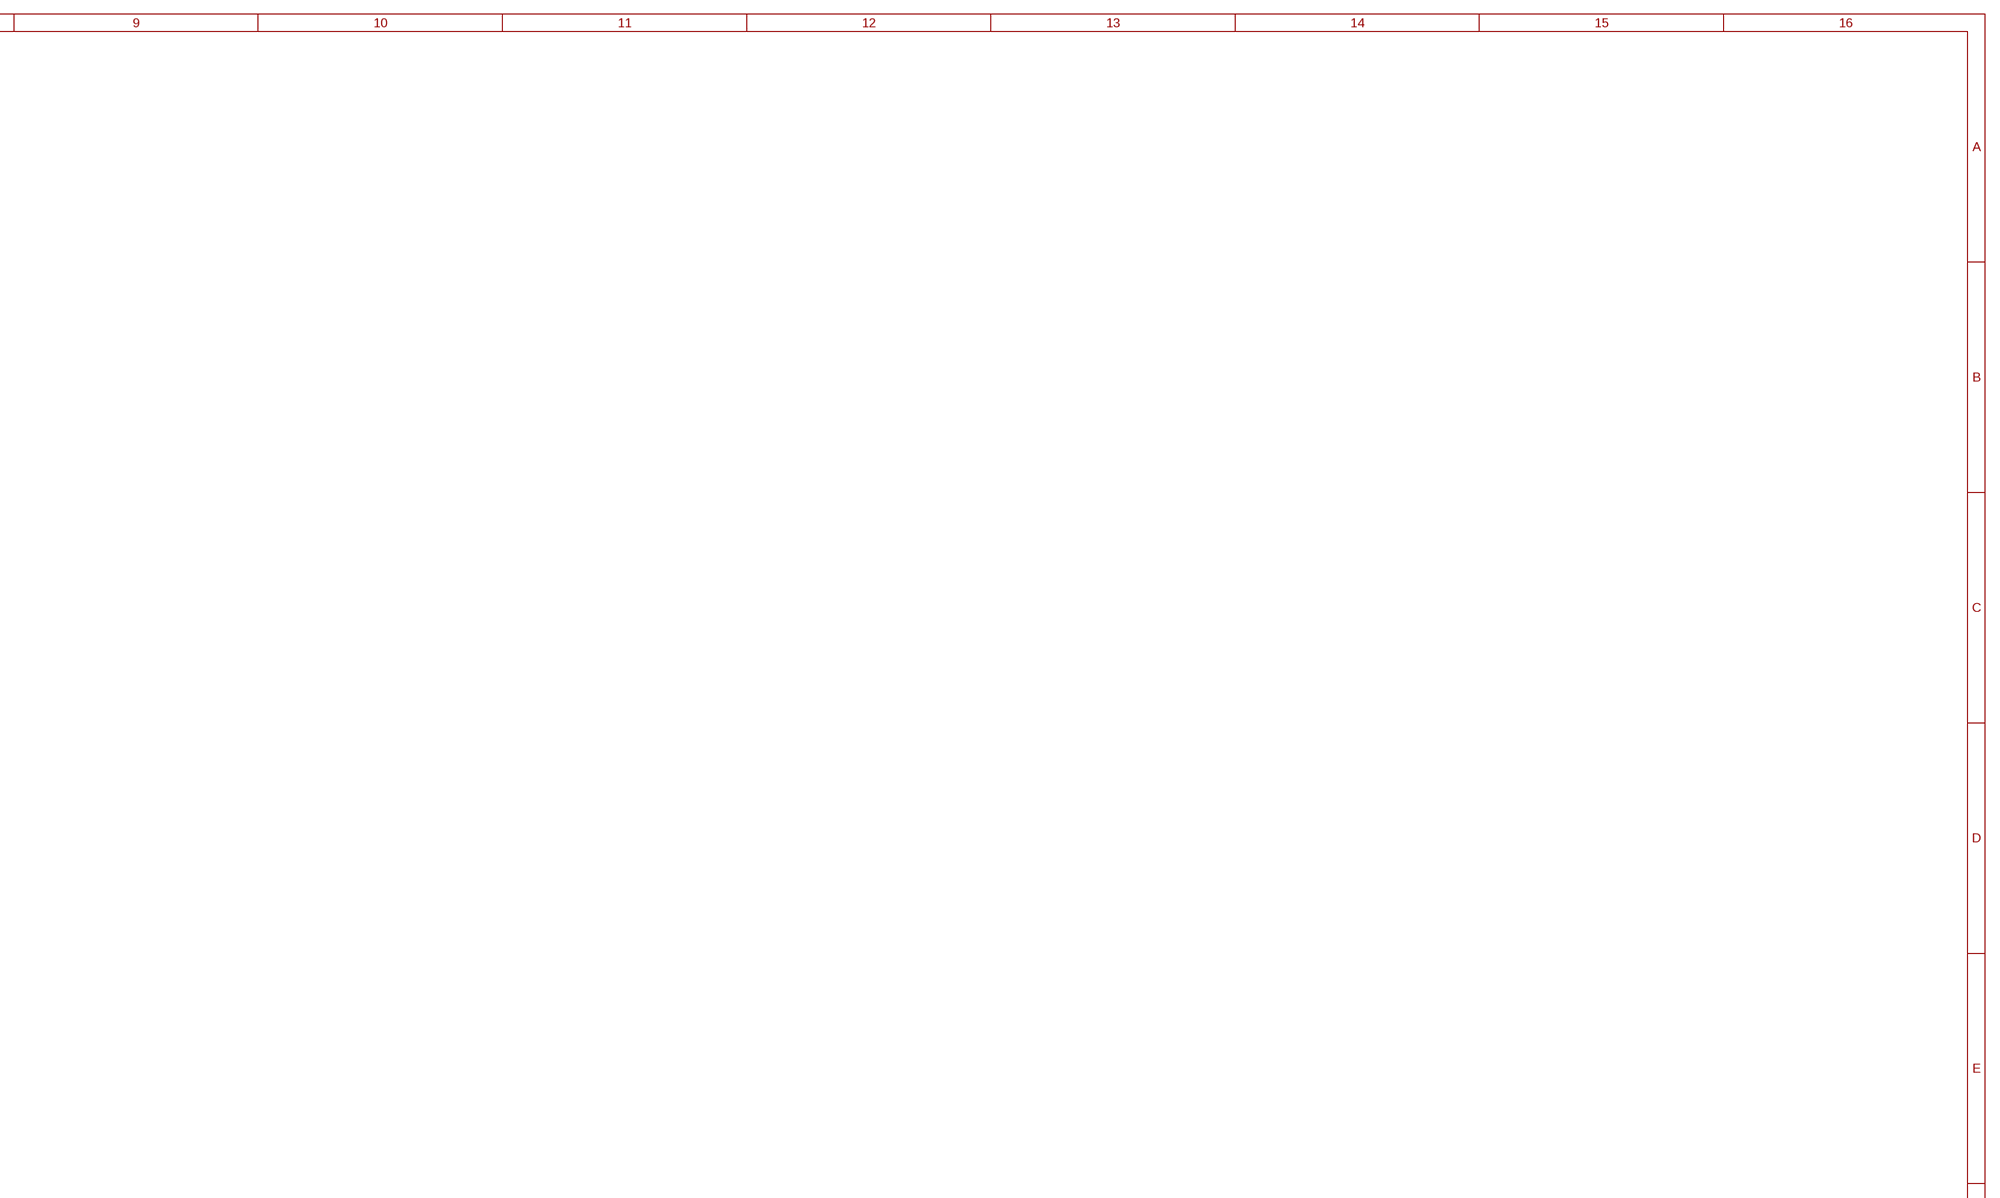
[diagram p4: schematic, sheet 2, part 2 of 3]
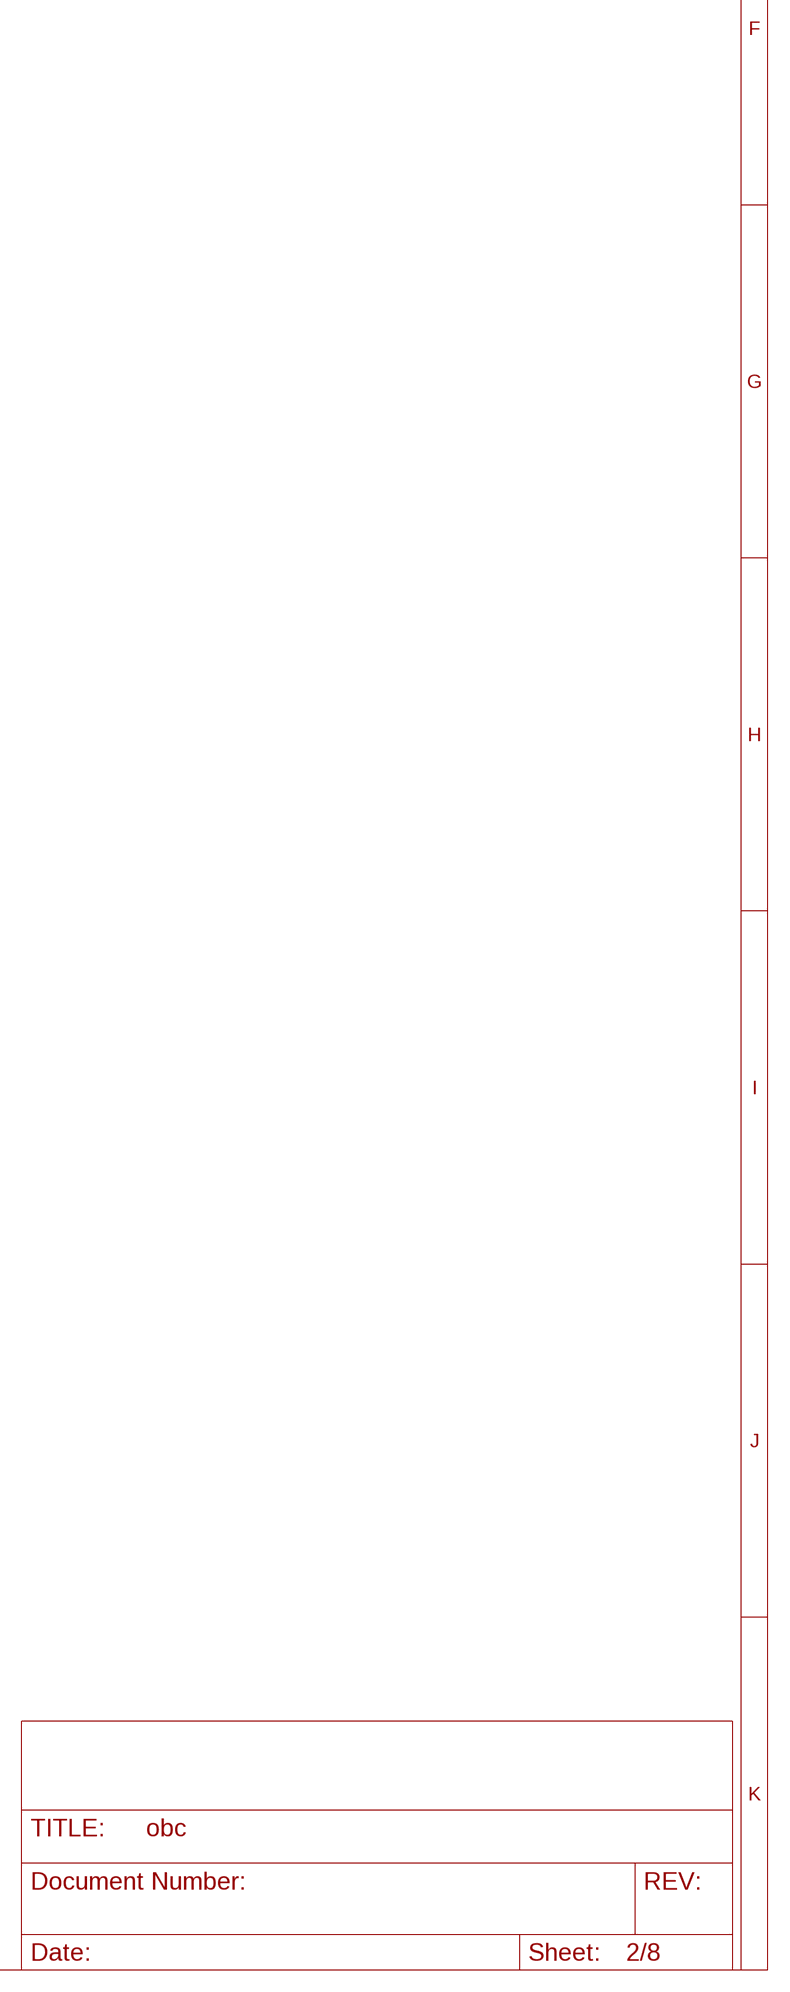
[diagram p5: schematic, sheet 2, part 3 of 3]

### Parts
C5  22uF  C-EUC0402K  [C0402K]
C6  4.7uF  C-EUC0402K  [C0402K]
C7  0.1uF  C-EUC0402K  [C0402K]
C8  0.1uF  C-EUC0402K  [C0402K]
C9  0.1uF  C-EUC0402K  [C0402K]
C10  0.1uF  C-EUC0402K  [C0402K]
C11  0.1uF  C-EUC0402K  [C0402K]
C12  0.1uF  C-EUC0402K  [C0402K]
C13  0.1uF  C-EUC0402K  [C0402K]
IC1  IS42S16160J-6BLI  [BGA54C80P9X9_800X800X120]
L1  120 Ohm  BLM15HB121SN1  [0402]
R13  0 Ohm  R-EU_R0402  [R0402]
R14  100K Ohm  R-EU_R0402  [R0402]
R15  100K Ohm  R-EU_R0402  [R0402]

### Nets
DCDC_3V3: L1.1 ; also sheet 1,4,5
GND: C5.2 C6.2 C7.2 C8.2 C9.2 C10.2 C11.2 C12.2 C13.2 IC1.A1(VSS_1) IC1.A3(VSSQ_1) IC1.B7(VSSQ_2) IC1.C3(VSSQ_3) IC1.D7(VSSQ_4) IC1.E3(VSS_2) IC1.J1(VSS_3) R14.1 ; also sheet 1,3,4,5,6
N$12: IC1.F3(CKE) R14.2
N$13: IC1.F2(CLK) R13.2
N$14: IC1.F1(DQMH)
N$15: IC1.E8(DQML)
N$16: IC1.G9(!CS) R15.1
N$17: R15.2
N$18: IC1.F9(!WE)
N$19: IC1.F8(!RAS)
N$20: IC1.F7(!CAS)
N$21: IC1.G8(BA1)
N$22: IC1.G7(BA0)
N$23: R13.1
N$24: IC1.J9(VDD_3)
N$25: IC1.E7(VDD_2)
N$28: IC1.A7(VDDQ_1) IC1.A9(VDD_1) IC1.B3(VDDQ_2) IC1.C7(VDDQ_3) IC1.D3(VDDQ_4)
SDRAM_3V3: C5.1 C6.1 C7.1 C8.1 C9.1 C10.1 C11.1 C12.1 C13.1 L1.2
SEMC_A0: IC1.H7(A0) ; also sheet 1
SEMC_A1: IC1.H8(A1) ; also sheet 1
SEMC_A2: IC1.J8(A2) ; also sheet 1
SEMC_A3: IC1.J7(A3) ; also sheet 1
SEMC_A4: IC1.J3(A4) ; also sheet 1
SEMC_A5: IC1.J2(A5) ; also sheet 1
SEMC_A6: IC1.H3(A6) ; also sheet 1
SEMC_A7: IC1.H2(A7) ; also sheet 1
SEMC_A8: IC1.H1(A8) ; also sheet 1
SEMC_A9: IC1.G3(A9) ; also sheet 1
SEMC_A10: IC1.H9(A10) ; also sheet 1
SEMC_A11: IC1.G2(A11) ; also sheet 1
SEMC_A12: IC1.G1(A12) ; also sheet 1
SEMC_D0: IC1.A8(DQ0) ; also sheet 1
SEMC_D1: IC1.B9(DQ1) ; also sheet 1
SEMC_D2: IC1.B8(DQ2) ; also sheet 1
SEMC_D3: IC1.C9(DQ3) ; also sheet 1
SEMC_D4: IC1.C8(DQ4) ; also sheet 1
SEMC_D5: IC1.D9(DQ5) ; also sheet 1
SEMC_D6: IC1.D8(DQ6) ; also sheet 1
SEMC_D7: IC1.E9(DQ7) ; also sheet 1
SEMC_D8: IC1.E1(DQ8) ; also sheet 1
SEMC_D9: IC1.D2(DQ9) ; also sheet 1
SEMC_D10: IC1.D1(DQ10) ; also sheet 1
SEMC_D11: IC1.C2(DQ11) ; also sheet 1
SEMC_D12: IC1.C1(DQ12) ; also sheet 1
SEMC_D13: IC1.B2(DQ13) ; also sheet 1
SEMC_D14: IC1.B1(DQ14) ; also sheet 1
SEMC_D15: IC1.A2(DQ15) ; also sheet 1
Unconnected: IC1.E2(NC)

## Sheet 3 of 8: HyperFlash
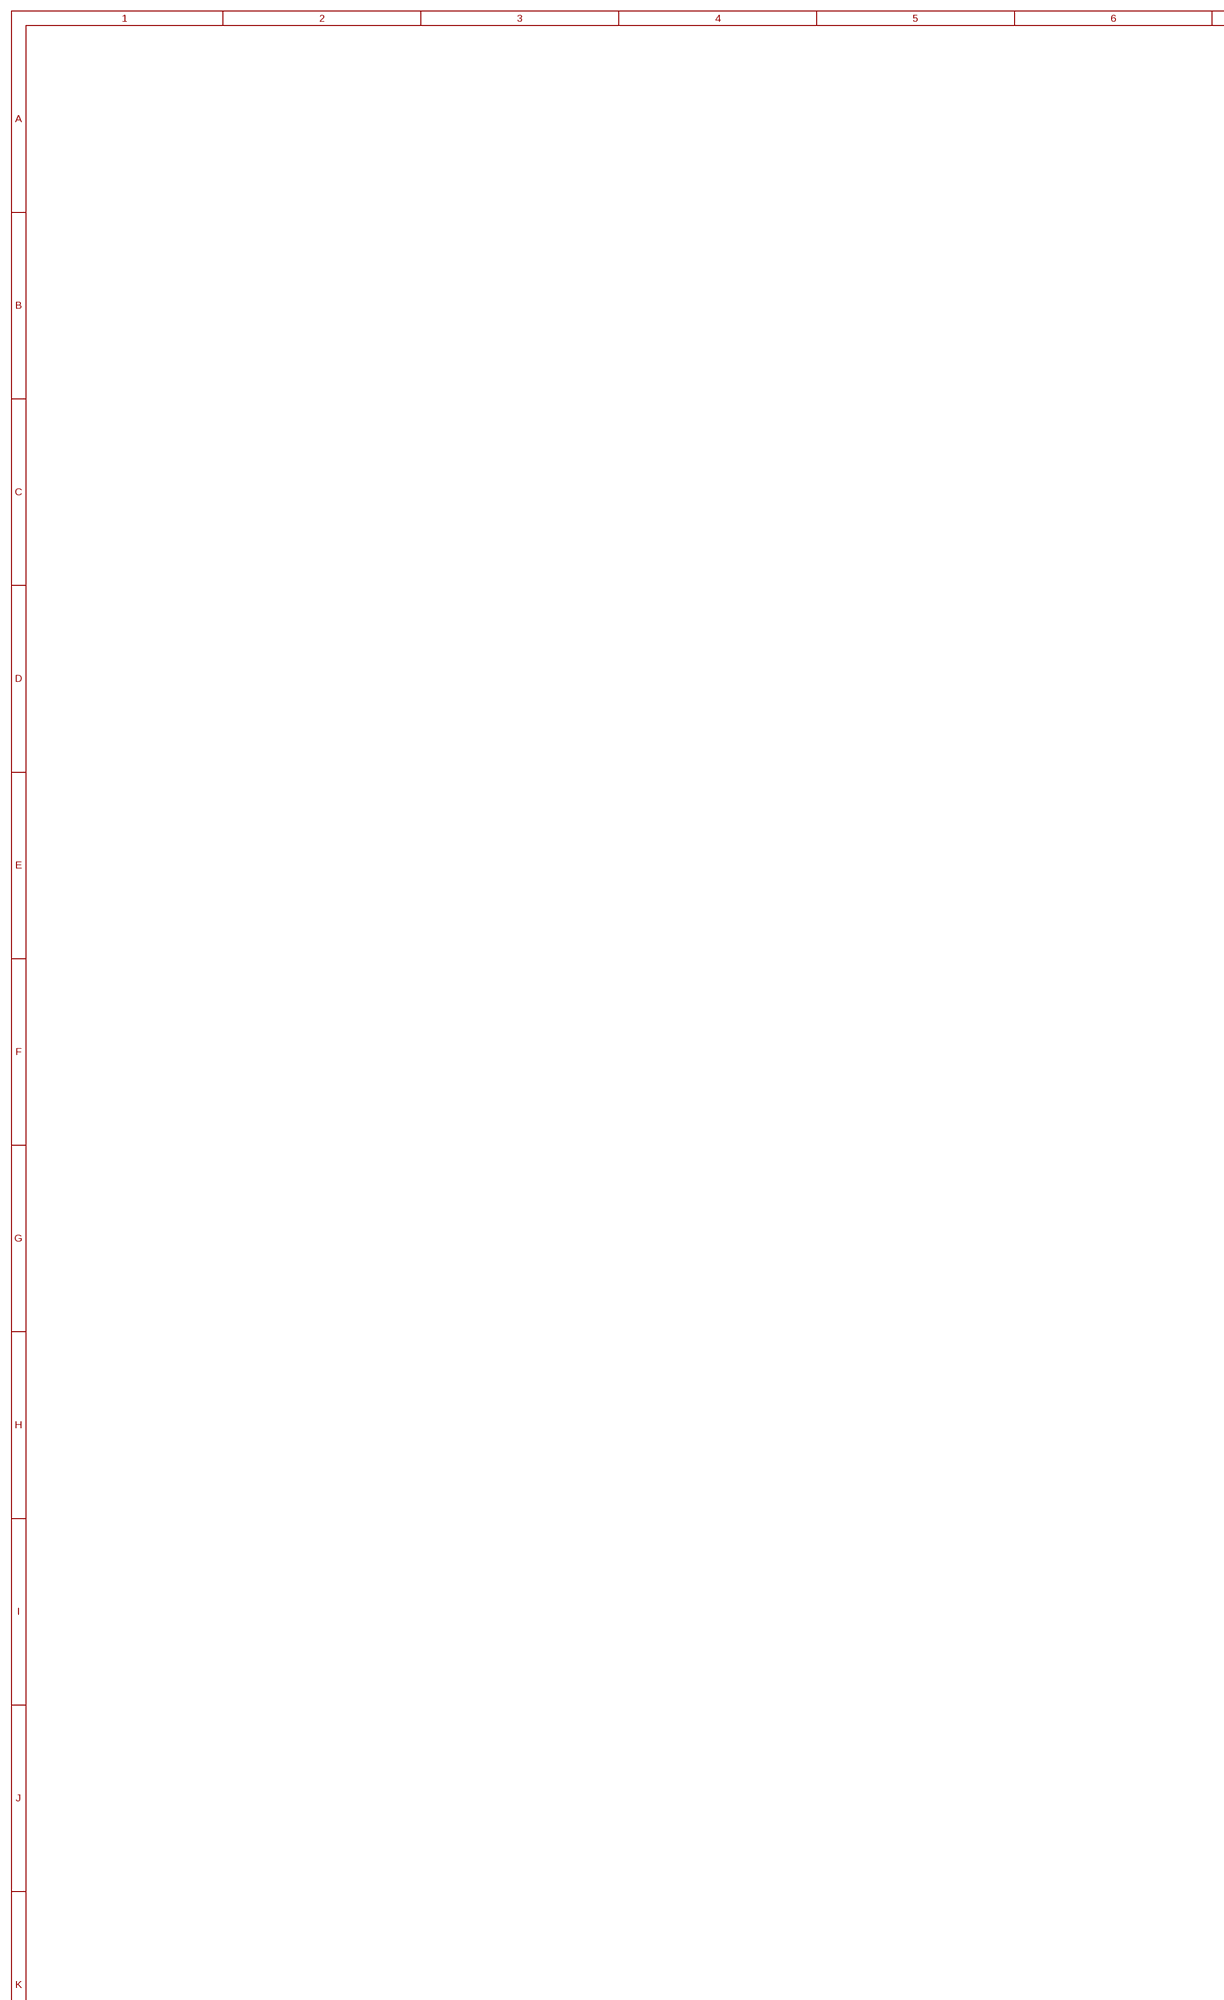
[diagram p6: schematic, sheet 3, part 1 of 3]
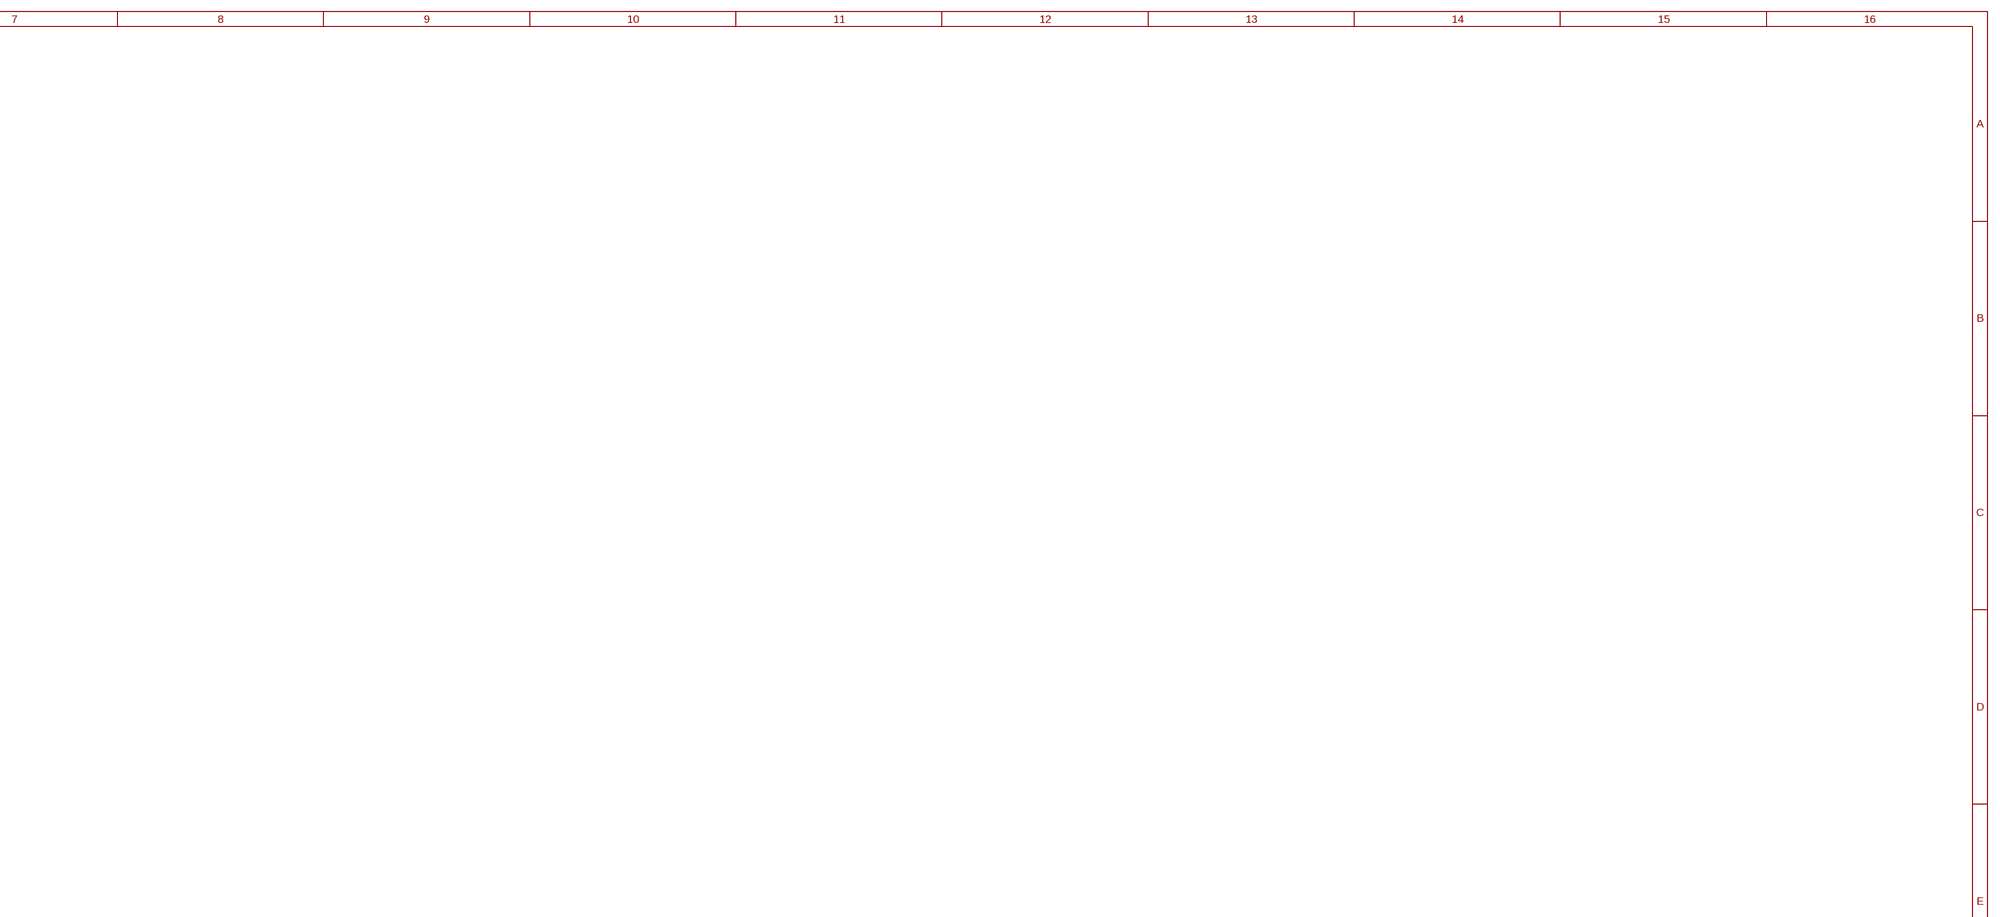
[diagram p7: schematic, sheet 3, part 2 of 3]
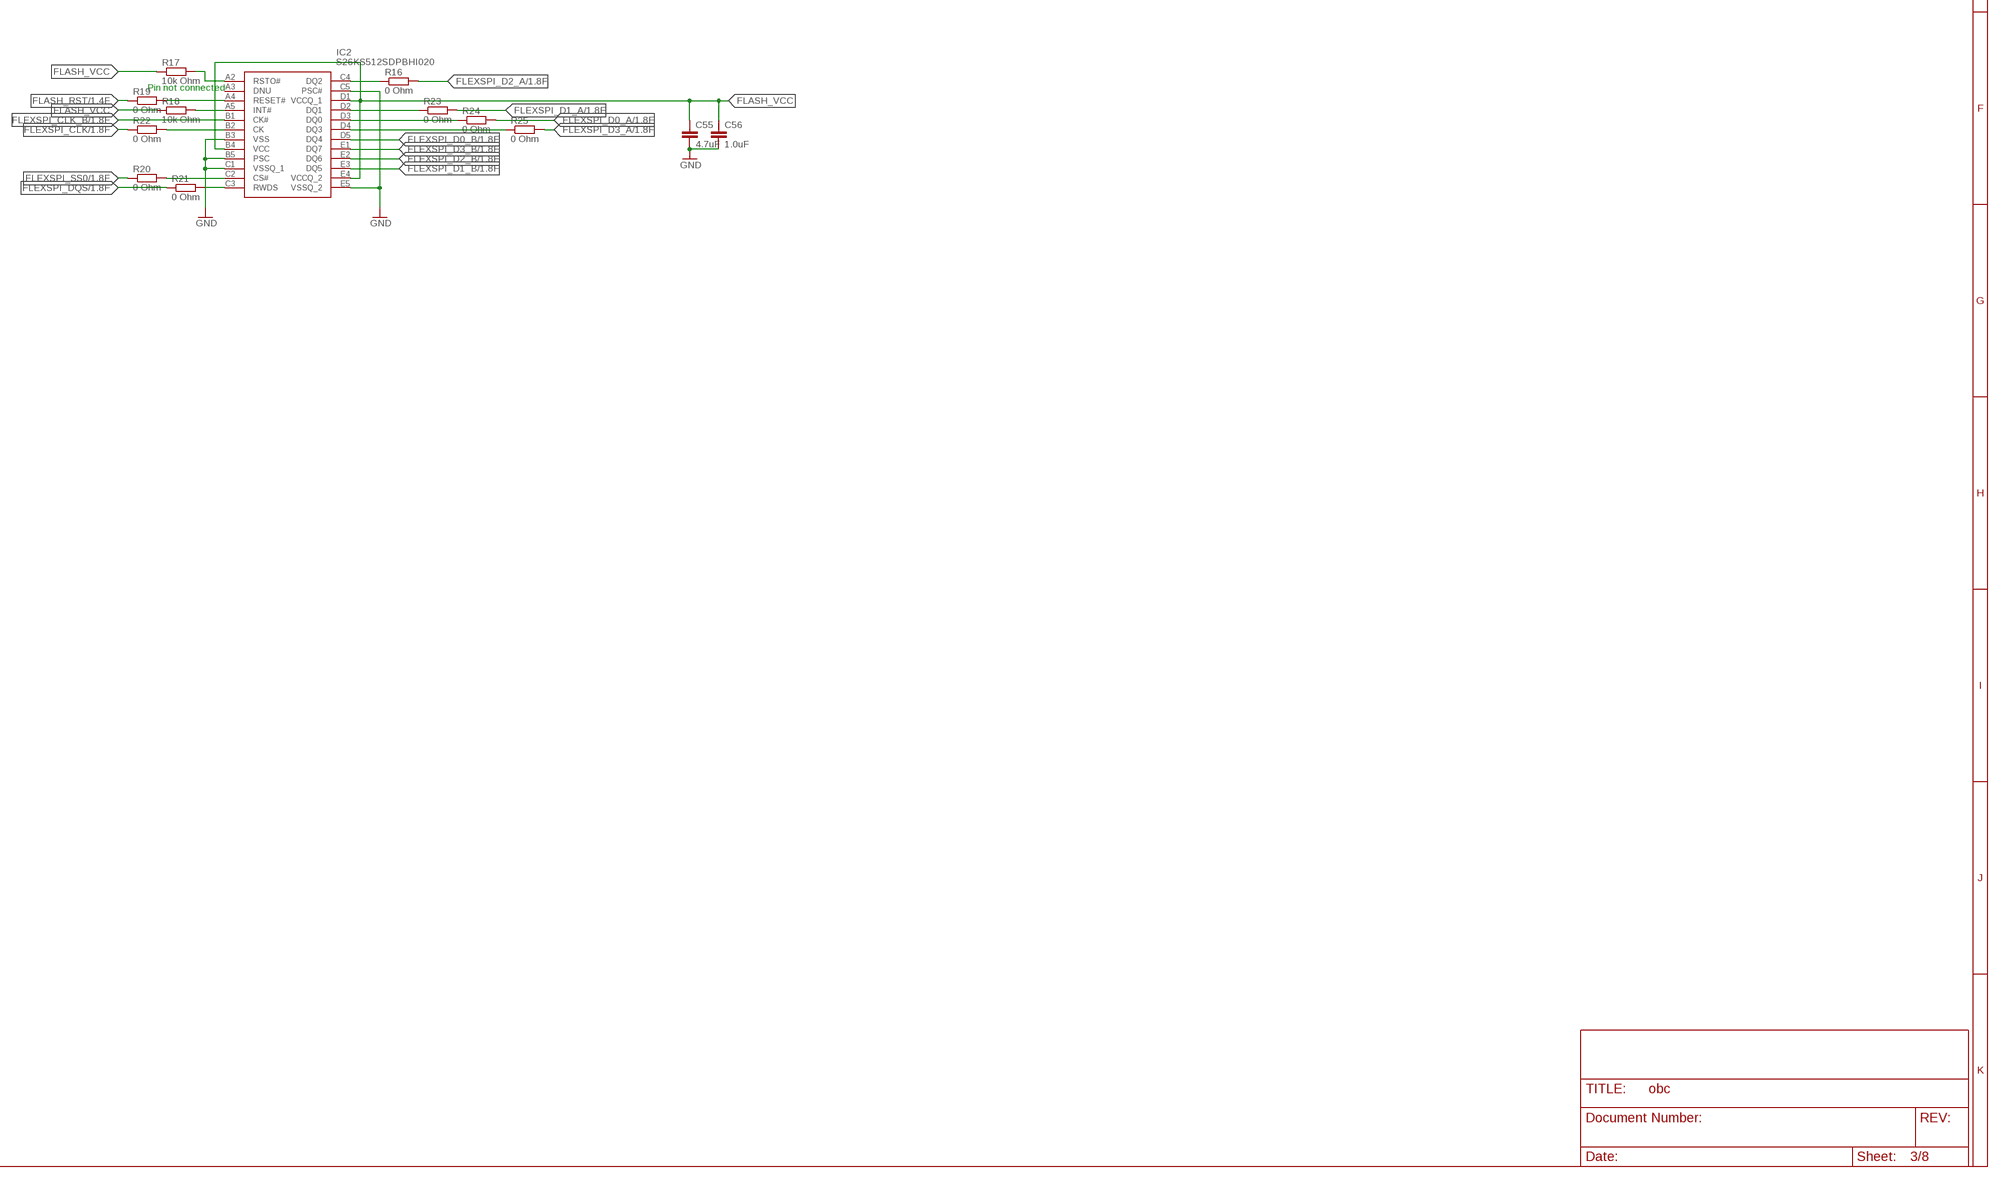
[diagram p8: schematic, sheet 3, part 3 of 3]

### Parts
C55  4.7uF  C-EUC0402K  [C0402K]
C56  1.0uF  C-EUC0402K  [C0402K]
IC2  S26KS512SDPBHI020  [BGA24C100P5X5_600X800X100]
R16  0 Ohm  R-EU_R0402  [R0402]
R17  10k Ohm  R-EU_R0402  [R0402]
R18  10k Ohm  R-EU_R0402  [R0402]
R19  0 Ohm  R-EU_R0402  [R0402]
R20  0 Ohm  R-EU_R0402  [R0402]
R21  0 Ohm  R-EU_R0402  [R0402]
R22  0 Ohm  R-EU_R0402  [R0402]
R23  0 Ohm  R-EU_R0402  [R0402]
R24  0 Ohm  R-EU_R0402  [R0402]
R25  0 Ohm  R-EU_R0402  [R0402]

### Nets
FLASH_RST: R19.1 ; also sheet 1
FLASH_VCC: C55.1 C56.1 IC2.B4(VCC) IC2.D1(VCCQ_1) IC2.E4(VCCQ_2) R17.1 R18.1
FLEXSPI_CLK: R22.1 ; also sheet 1
FLEXSPI_CLK_B: IC2.B1(CK#) ; also sheet 1
FLEXSPI_D0_A: R24.2 ; also sheet 1
FLEXSPI_D0_B: IC2.D5(DQ4) ; also sheet 1
FLEXSPI_D1_A: R23.2 ; also sheet 1
FLEXSPI_D1_B: IC2.E3(DQ5) ; also sheet 1
FLEXSPI_D2_A: R16.2 ; also sheet 1
FLEXSPI_D2_B: IC2.E2(DQ6) ; also sheet 1
FLEXSPI_D3_A: R25.2 ; also sheet 1
FLEXSPI_D3_B: IC2.E1(DQ7) ; also sheet 1
FLEXSPI_DQS: R21.1 ; also sheet 1
FLEXSPI_SS0: R20.1 ; also sheet 1
GND: C55.2 C56.2 IC2.B3(VSS) IC2.B5(PSC) IC2.C1(VSSQ_1) IC2.C5(PSC#) IC2.E5(VSSQ_2) ; also sheet 1,2,4,5,6
N$26: IC2.C4(DQ2) R16.1
N$27: IC2.A5(INT#) R18.2
N$29: IC2.A2(RSTO#) R17.2
N$30: IC2.A4(RESET#) R19.2
N$31: IC2.C2(CS#) R20.2
N$32: IC2.C3(RWDS) R21.2
N$33: IC2.D2(DQ1) R23.1
N$34: IC2.B2(CK) R22.2
N$35: IC2.D3(DQ0) R24.1
N$36: IC2.D4(DQ3) R25.1
Unconnected: IC2.A3(DNU)

### Notes on the sheet
- Pin not connected

## Sheet 4 of 8: JTAG
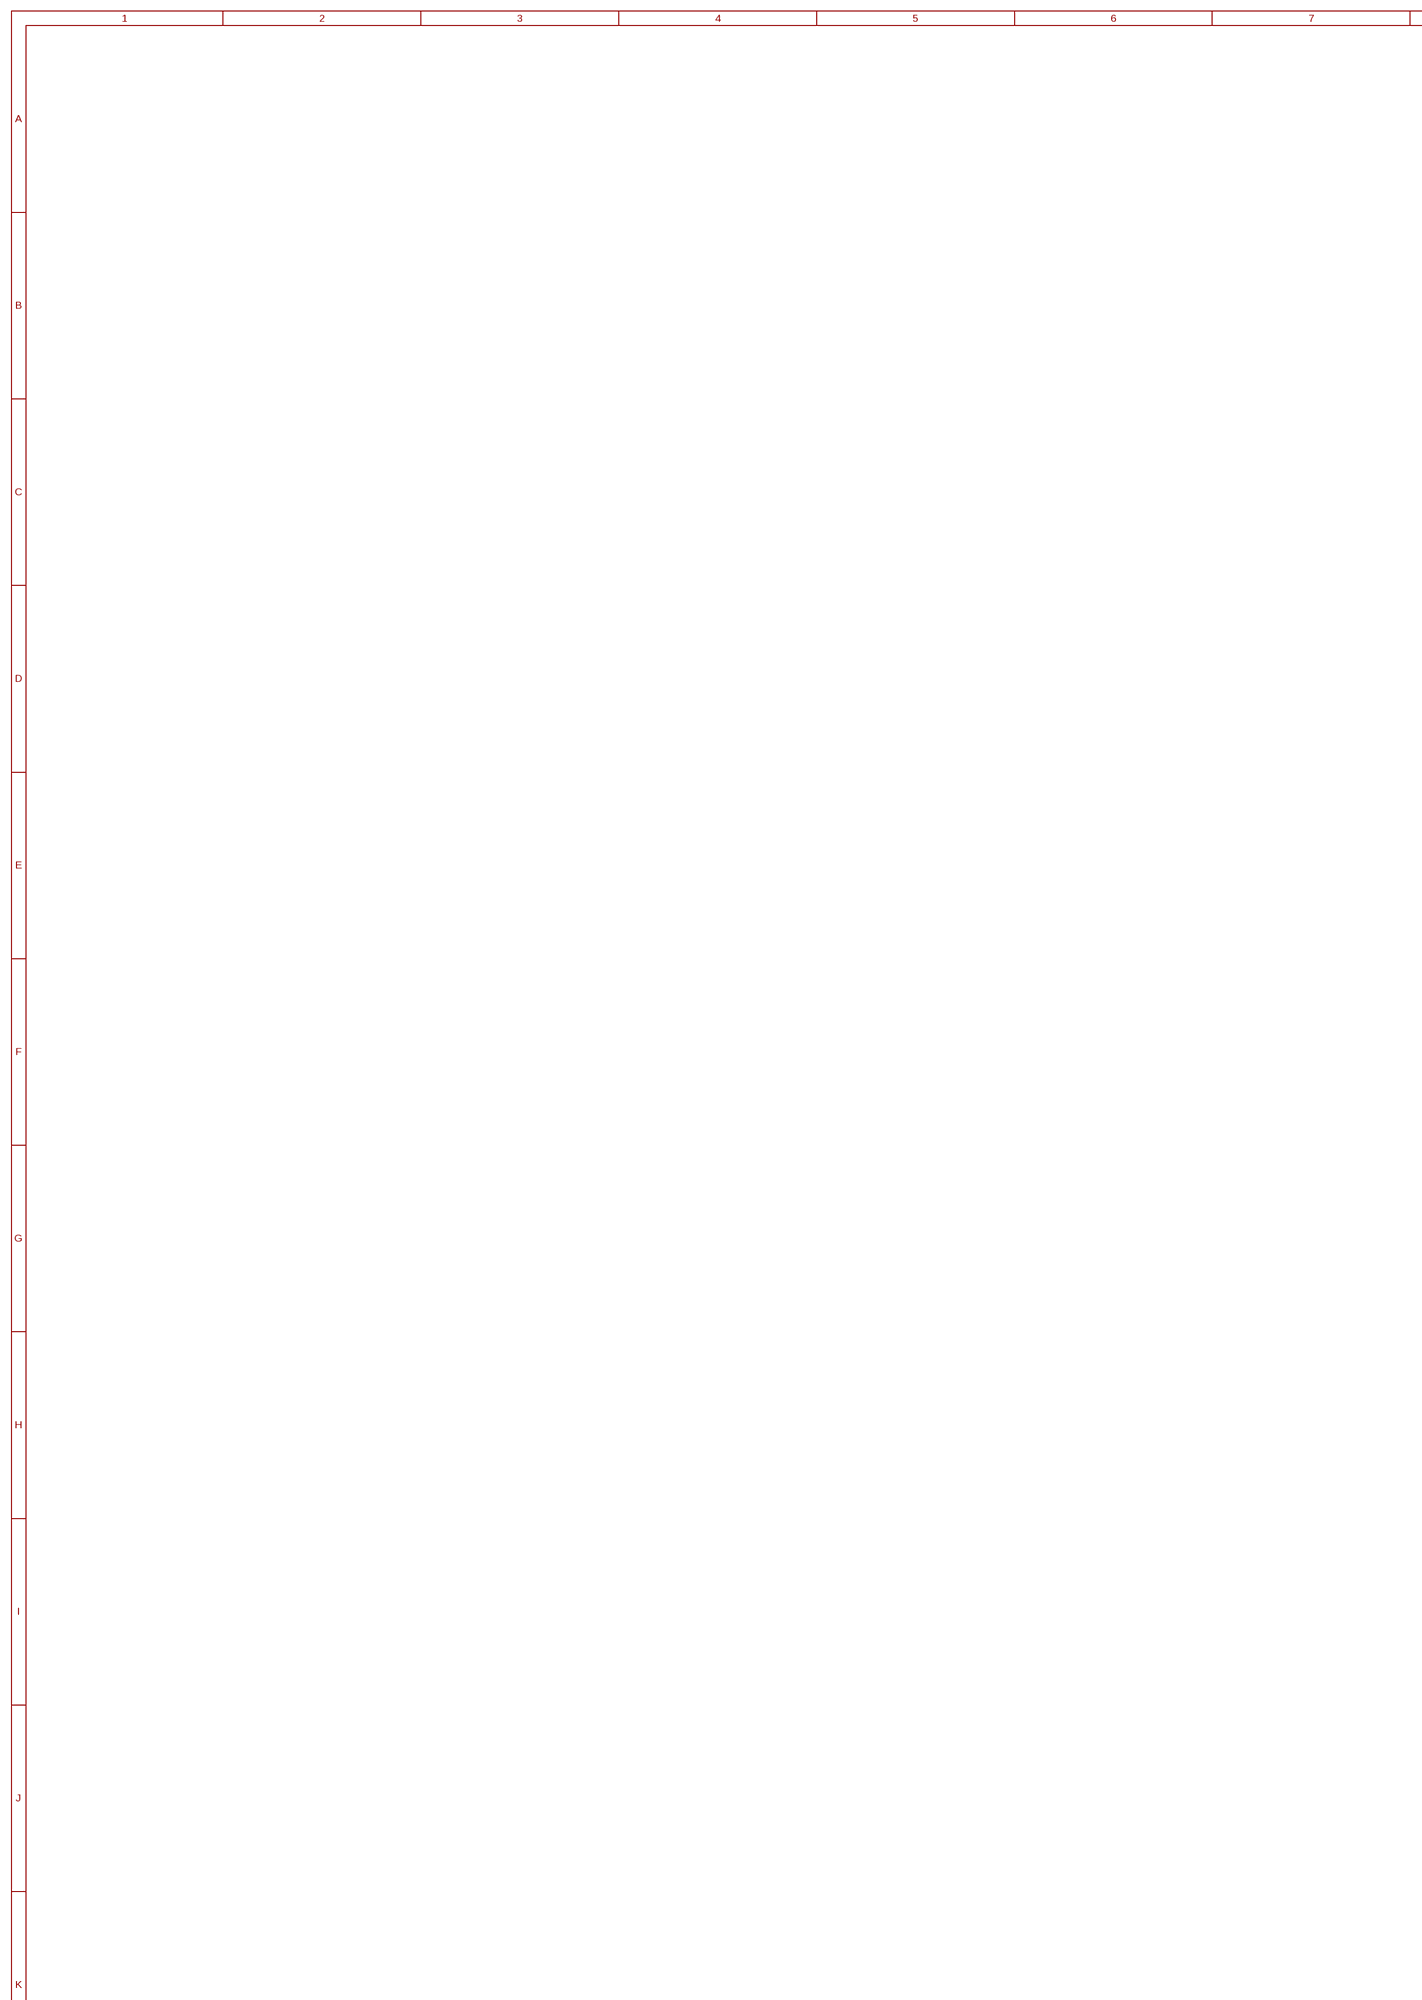
[diagram p9: schematic, sheet 4, part 1 of 2]
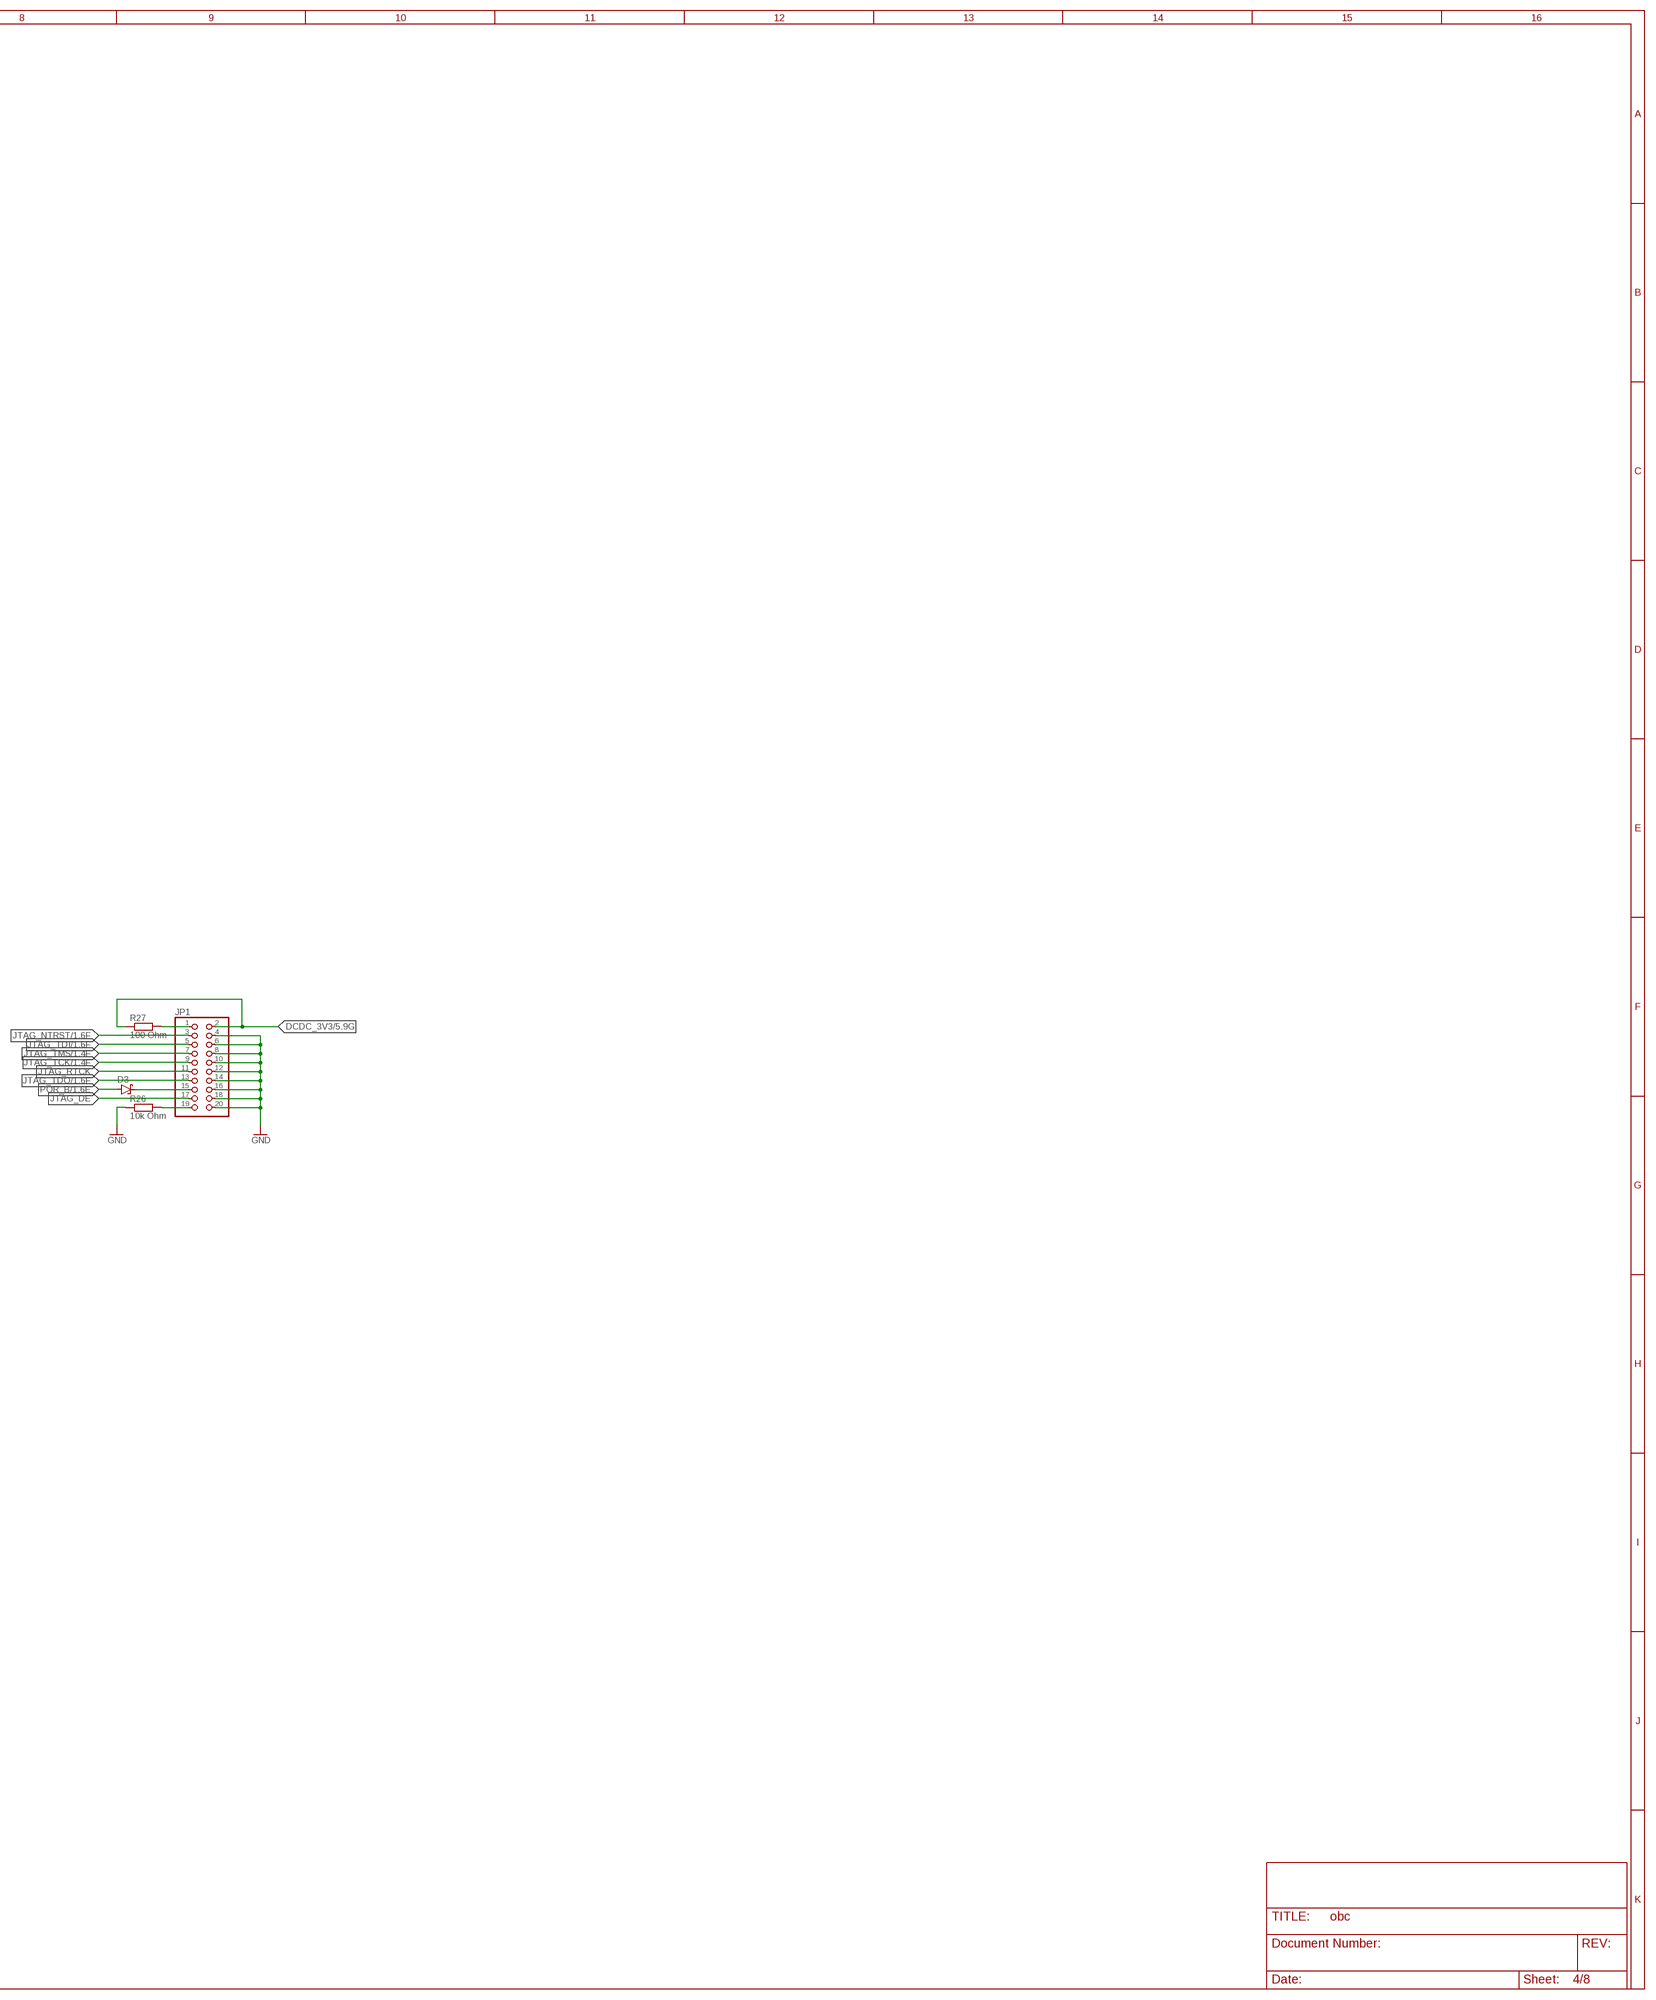
[diagram p10: schematic, sheet 4, part 2 of 2]

### Parts
D3  SCHOTTKY-DIODESMC  [SMC]
JP1  PINHD-2X10  [2X10]
R26  10k Ohm  R-EU_R0402  [R0402]
R27  100 Ohm  R-EU_R0402  [R0402]

### Nets
DCDC_3V3: JP1.2 R27.1 ; also sheet 1,2,5
GND: JP1.4 JP1.6 JP1.8 JP1.10 JP1.12 JP1.14 JP1.16 JP1.18 JP1.20 R26.1 ; also sheet 1,2,3,5,6
JTAG_DE: JP1.17
JTAG_NTRST: JP1.3 ; also sheet 1
JTAG_RTCK: JP1.11
JTAG_TCK: JP1.9 ; also sheet 1
JTAG_TDI: JP1.5 ; also sheet 1
JTAG_TDO: JP1.13 ; also sheet 1
JTAG_TMS: JP1.7 ; also sheet 1
N$37: JP1.19 R26.2
N$38: JP1.1 R27.2
N$39: D3.C JP1.15
POR_B: D3.A ; also sheet 1

## Sheet 5 of 8: USB
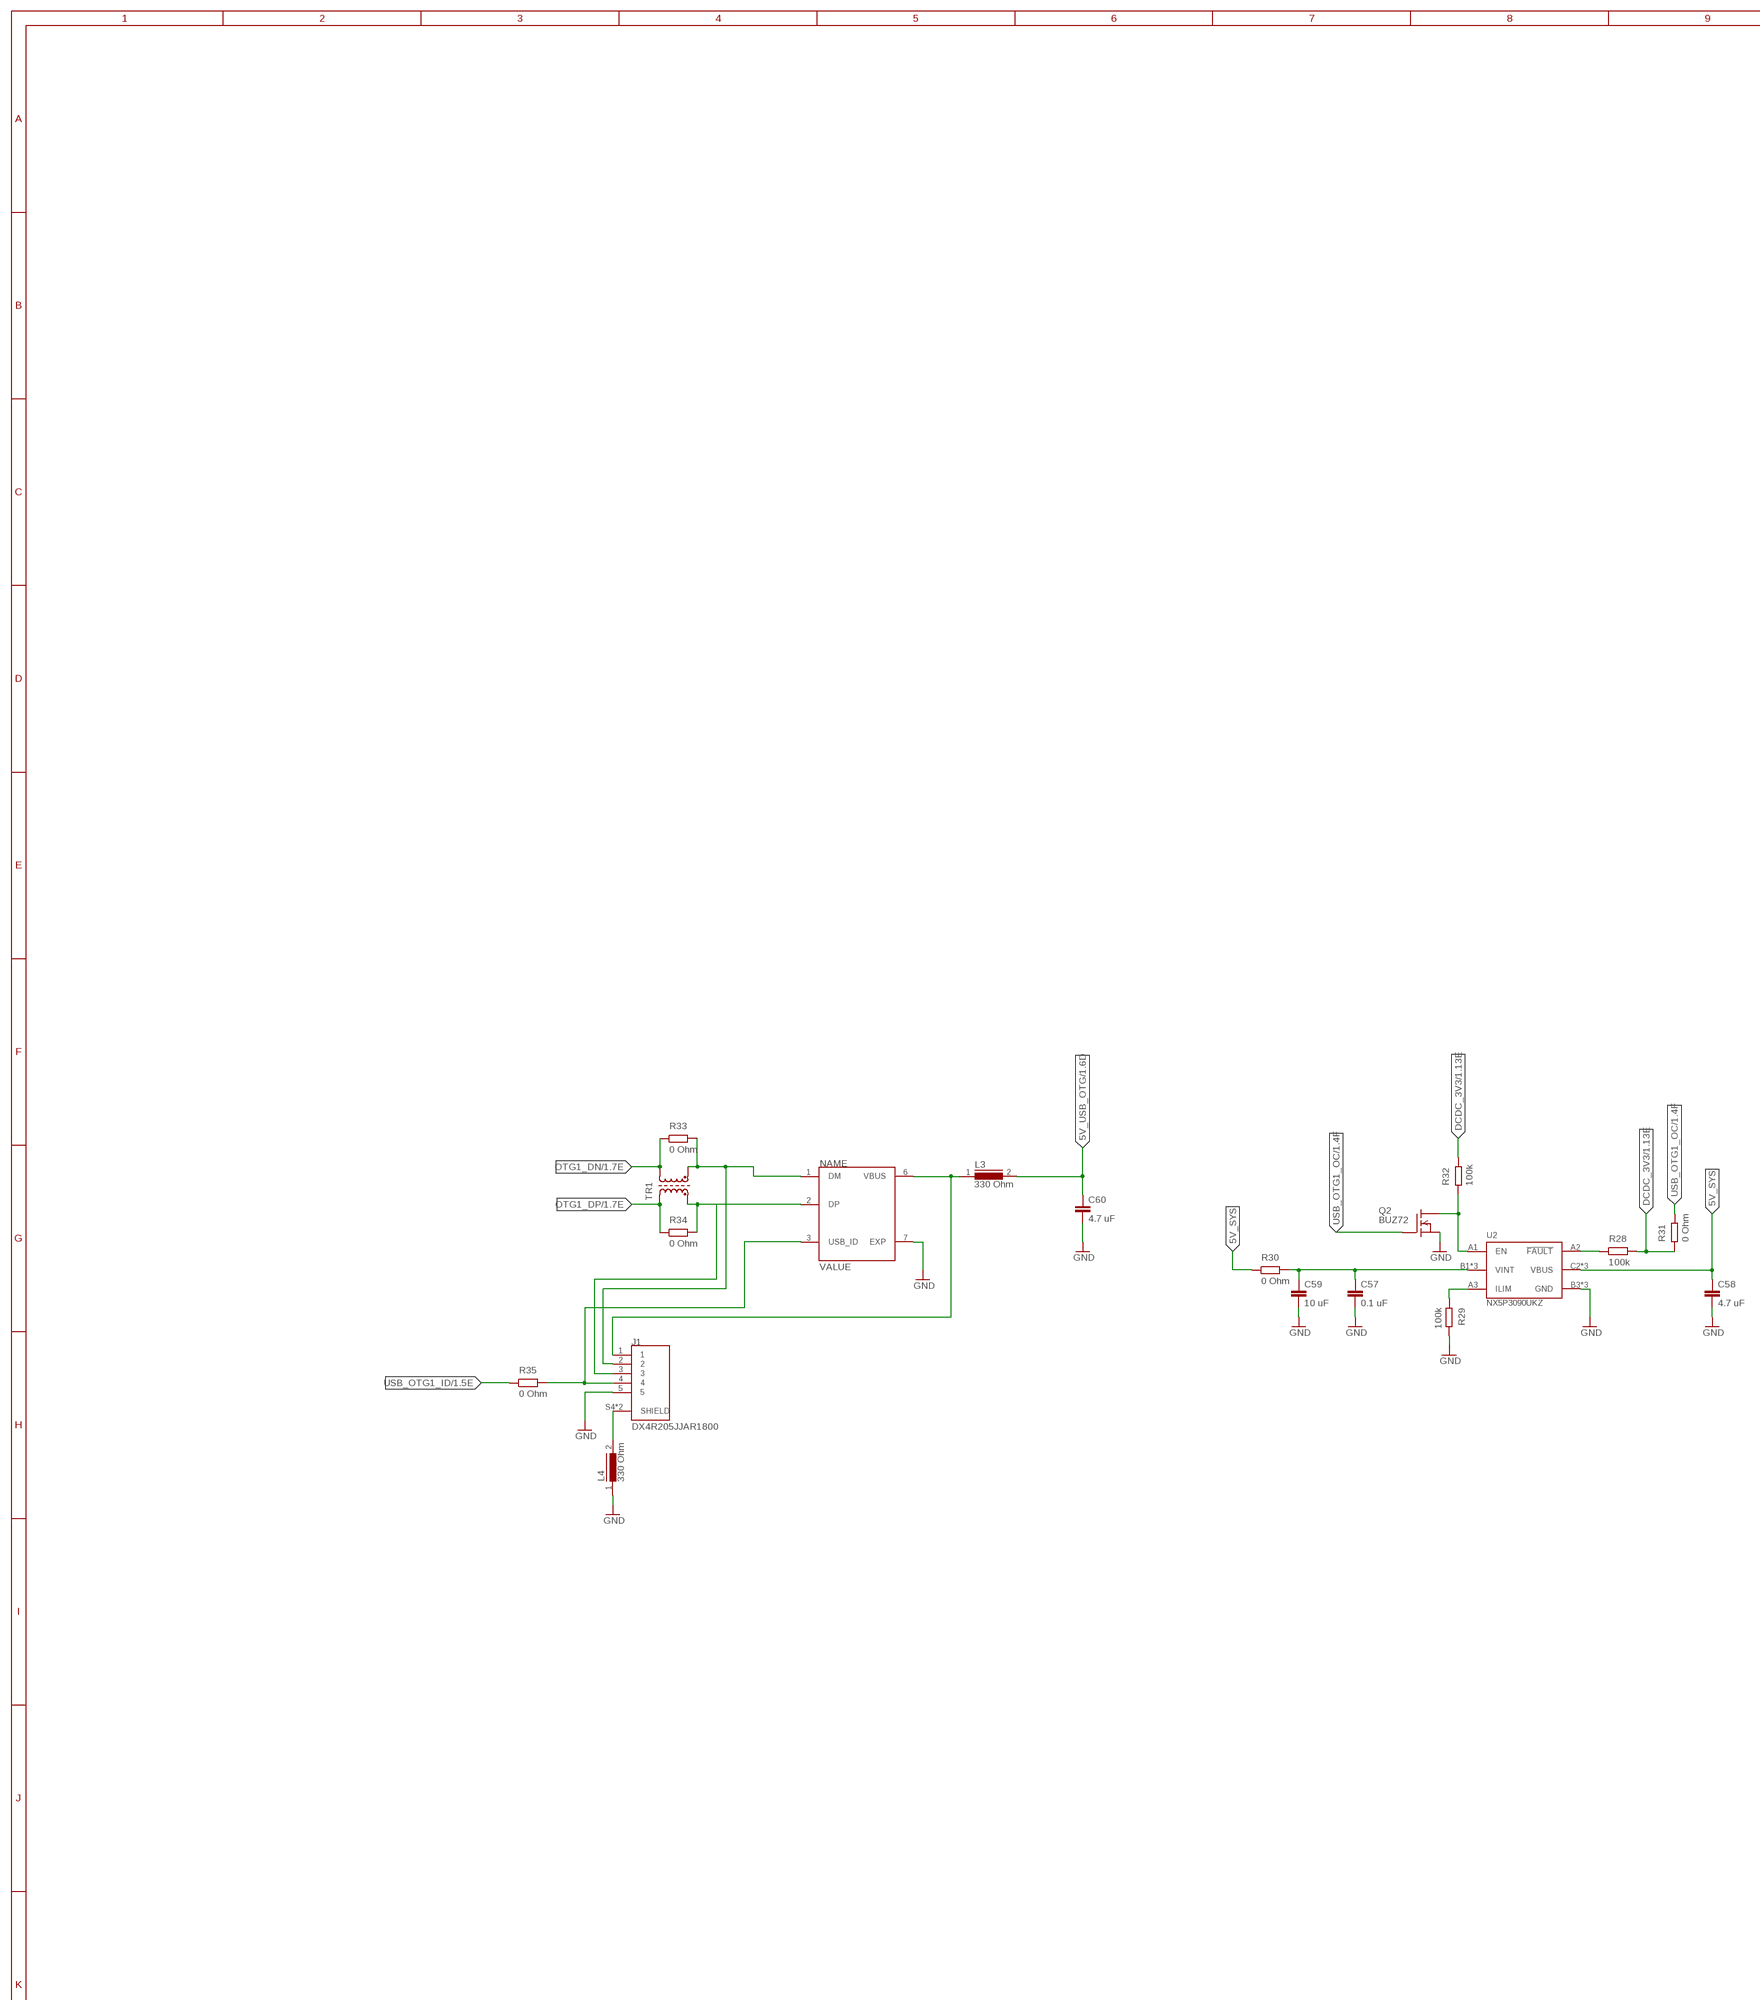
[diagram p11: schematic, sheet 5, part 1 of 3]
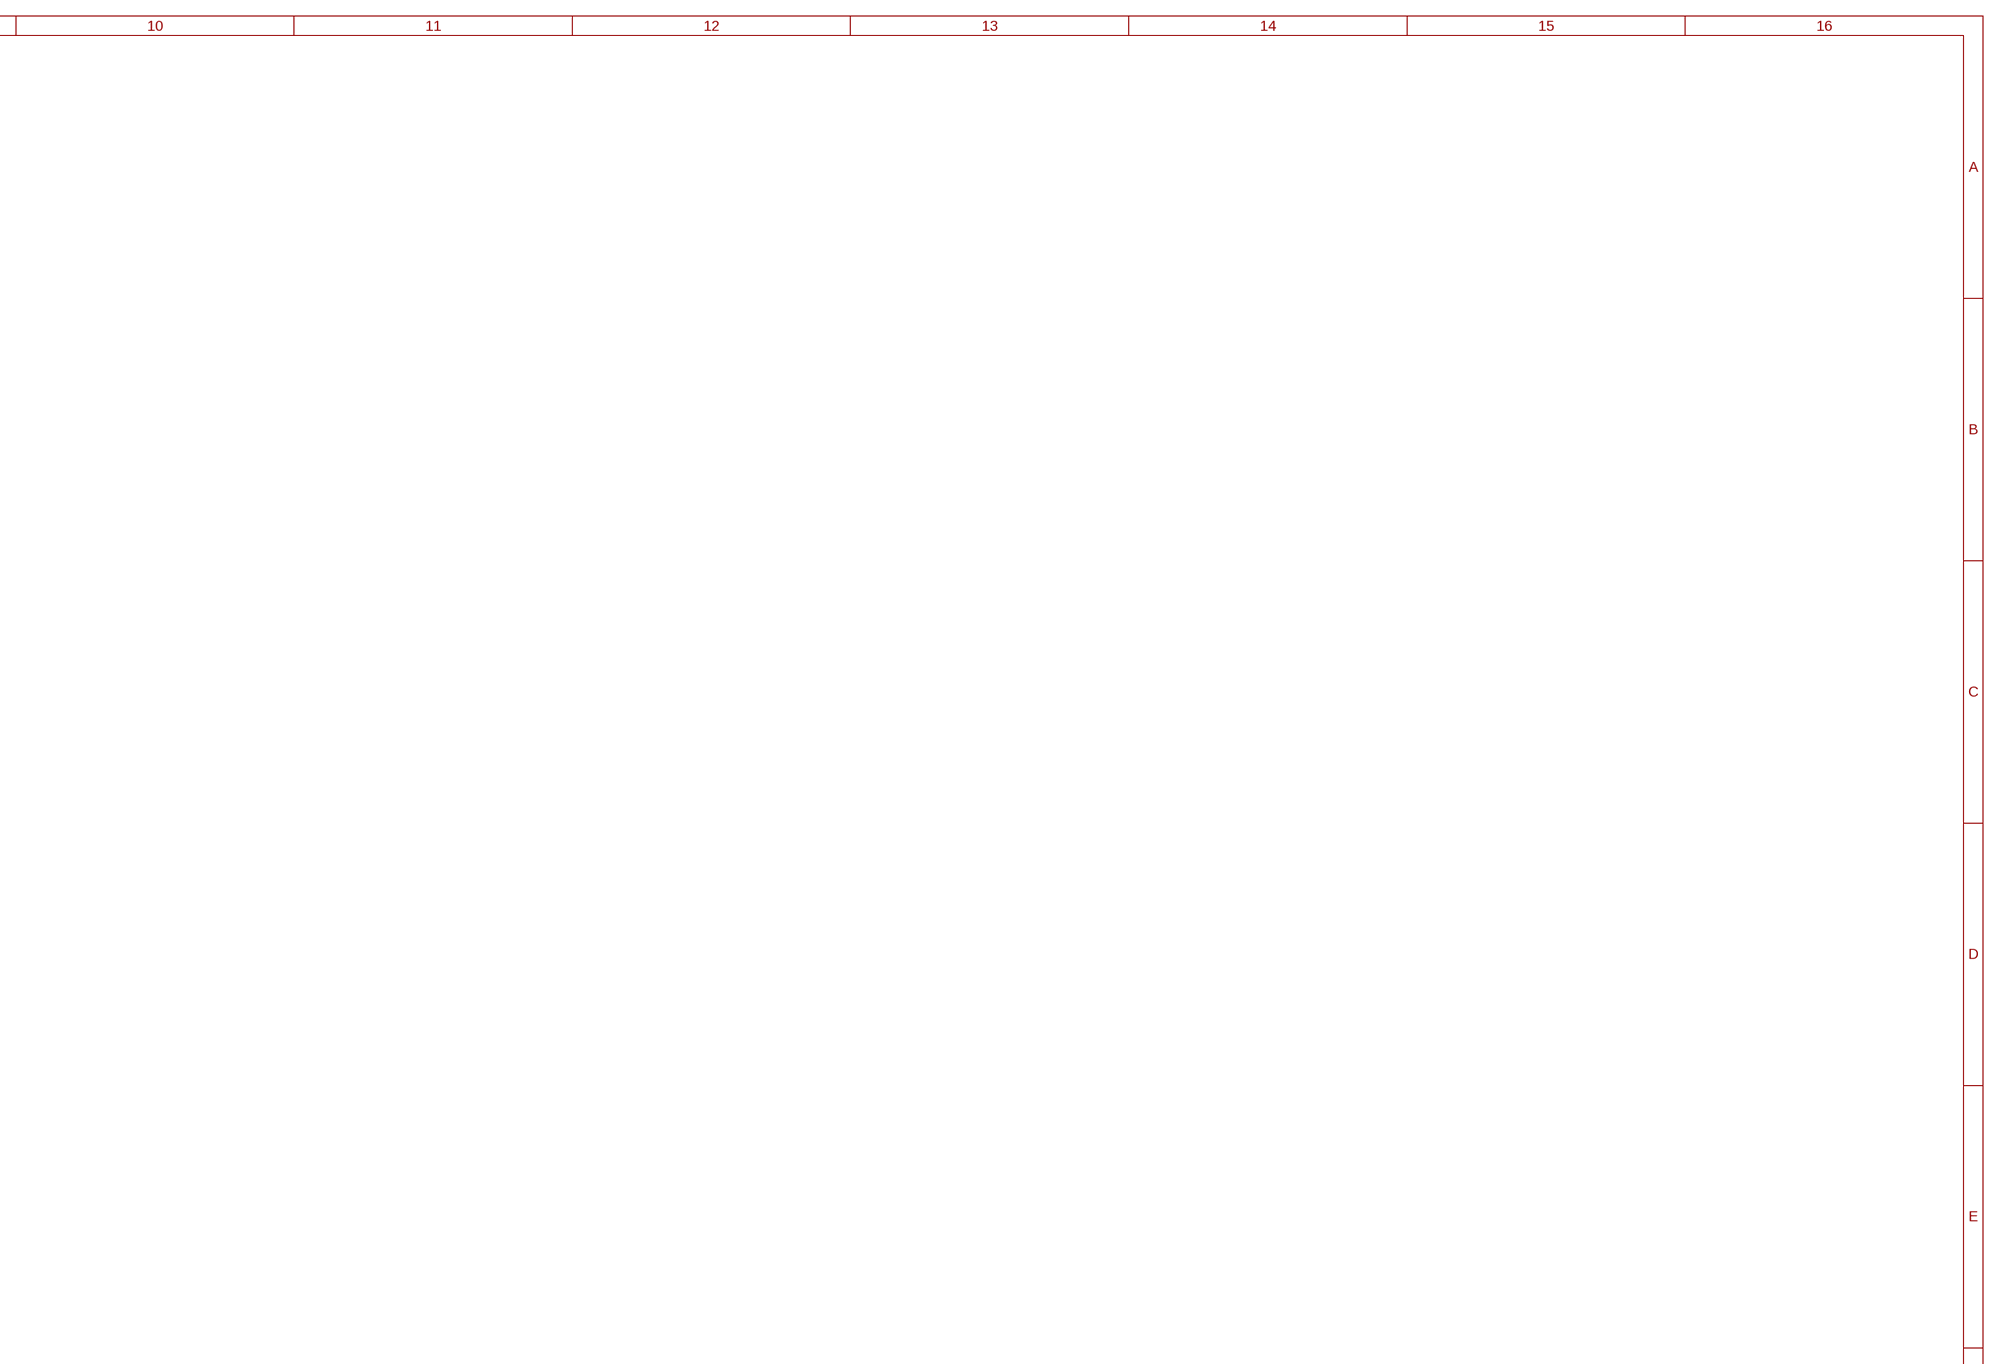
[diagram p12: schematic, sheet 5, part 2 of 3]
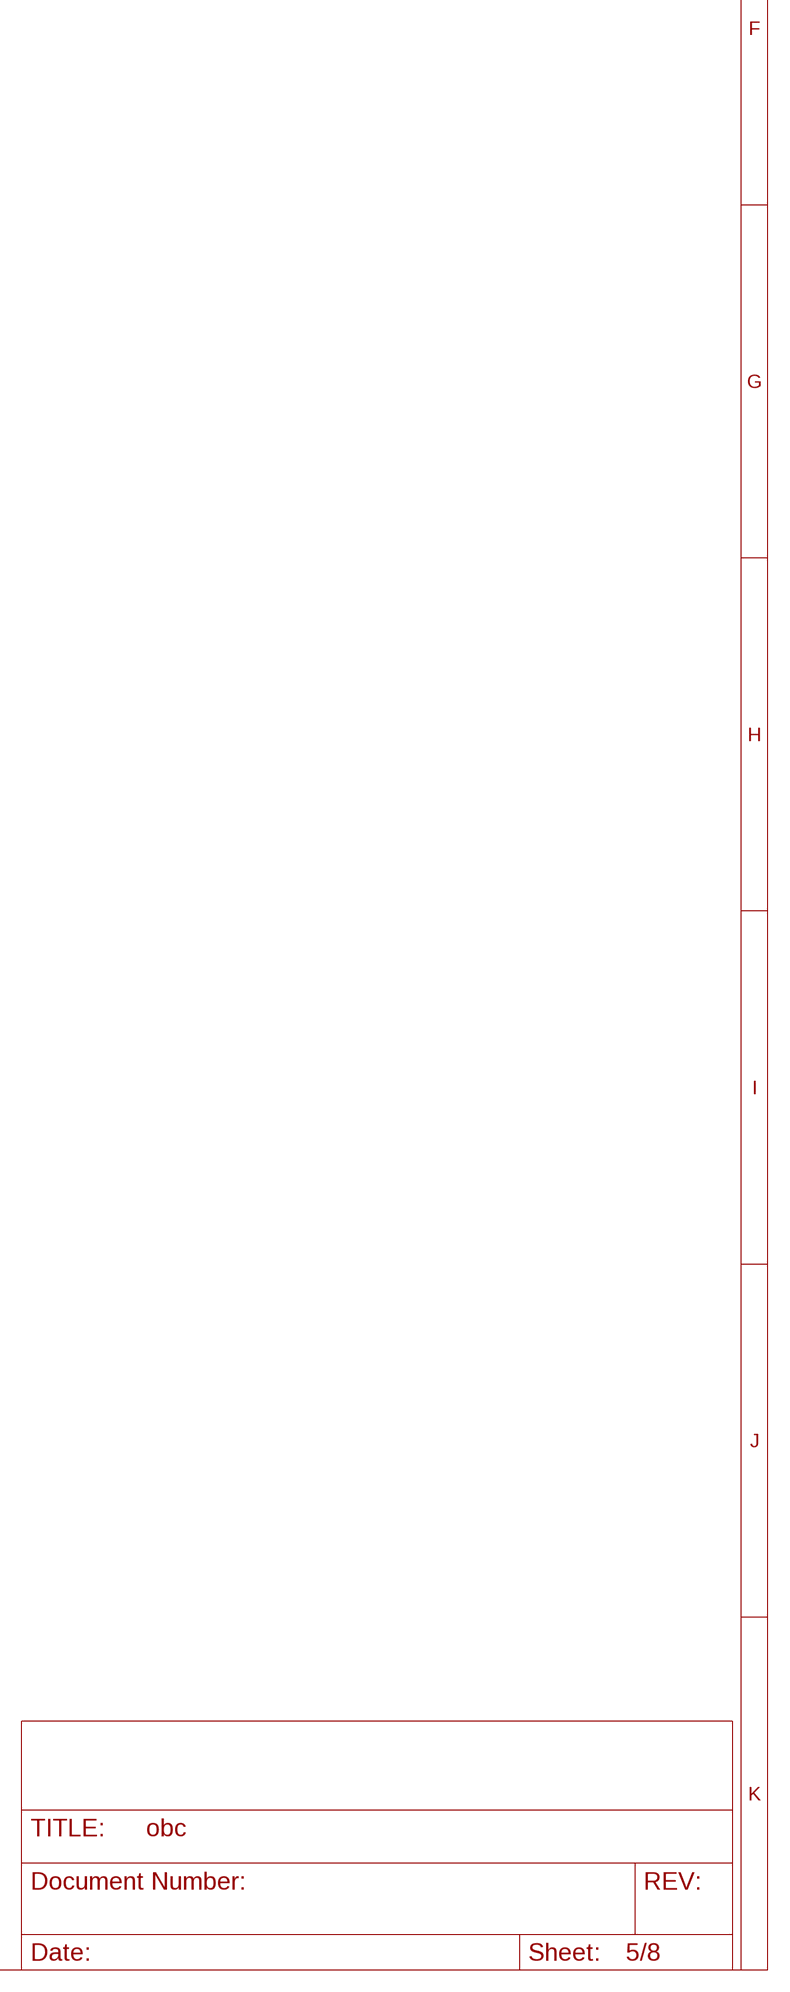
[diagram p13: schematic, sheet 5, part 3 of 3]

### Parts
C57  0.1 uF  C-EUC0402K  [C0402K]
C58  4.7 uF  C-EUC0402K  [C0402K]
C59  10 uF  C-EUC0402K  [C0402K]
C60  4.7 uF  C-EUC0402K  [C0402K]
J1  DX4R205JJAR1800  [JAE_DX4R205JJAR1800]
L3  330 Ohm  B82132  [SUKW2-22]
L4  330 Ohm  B82132  [SUKW2-22]
Q2  BUZ72  [TO220]
R28  100k  R  (no package)
R29  100k  R  (no package)
R30  0 Ohm  R  (no package)
R31  0 Ohm  R  (no package)
R32  100k  R  (no package)
R33  0 Ohm  R  (no package)
R34  0 Ohm  R  (no package)
R35  0 Ohm  R  (no package)
TR1  SM-T4  [SM-T4]
U2  NX5P3090UKZ  [BGA12CP40_3X4_135X165X56B26N]
U3  RCLAMP0854P.TCT  [SON50P160X160X65-7N]

### Nets
5V_SYS: R30.1
5V_USB_OTG: C60.1 L3.2 ; also sheet 1
DCDC_3V3: R32.2 ; also sheet 1,2,4
GND: C57.2 C58.2 C59.2 C60.2 J1.5 L4.1 Q2.3(S) R29.2 U2.B3(GND) U2.C3(GND) U2.D3(GND) U3.7(EXP) ; also sheet 1,2,3,4,6
N$40: R28.1 U2.A2(!FAULT)
N$41: R29.1 U2.A3(ILIM)
N$42: C57.1 C59.1 R30.2 U2.B1(VINT) U2.B2(VINT) U2.C1(VINT)
N$43: R31.2
N$44: Q2.2(D) R32.1 U2.A1(EN)
N$45: Q2.1(G)
N$46: J1.1 L3.1 U3.6(VBUS)
N$47: J1.2 R33.2 TR1.4(E2) U3.1(DM)
N$48: J1.3 R34.2 TR1.2(E1) U3.2(DP)
N$49: J1.4 R35.2 U3.3(USB_ID)
N$50: J1.S4(SHIELD) J1.S5(SHIELD) L4.2
N$51: C58.1 U2.C2(VBUS) U2.D1(VBUS) U2.D2(VBUS)
OTG1_DN: R33.1 TR1.5(A2) ; also sheet 1
OTG1_DP: R34.1 TR1.1(A1) ; also sheet 1
USB_OTG1_ID: R35.1 ; also sheet 1
USB_OTG1_OC: R28.2 R31.1 ; also sheet 1

## Sheet 6 of 8: PC104 Header
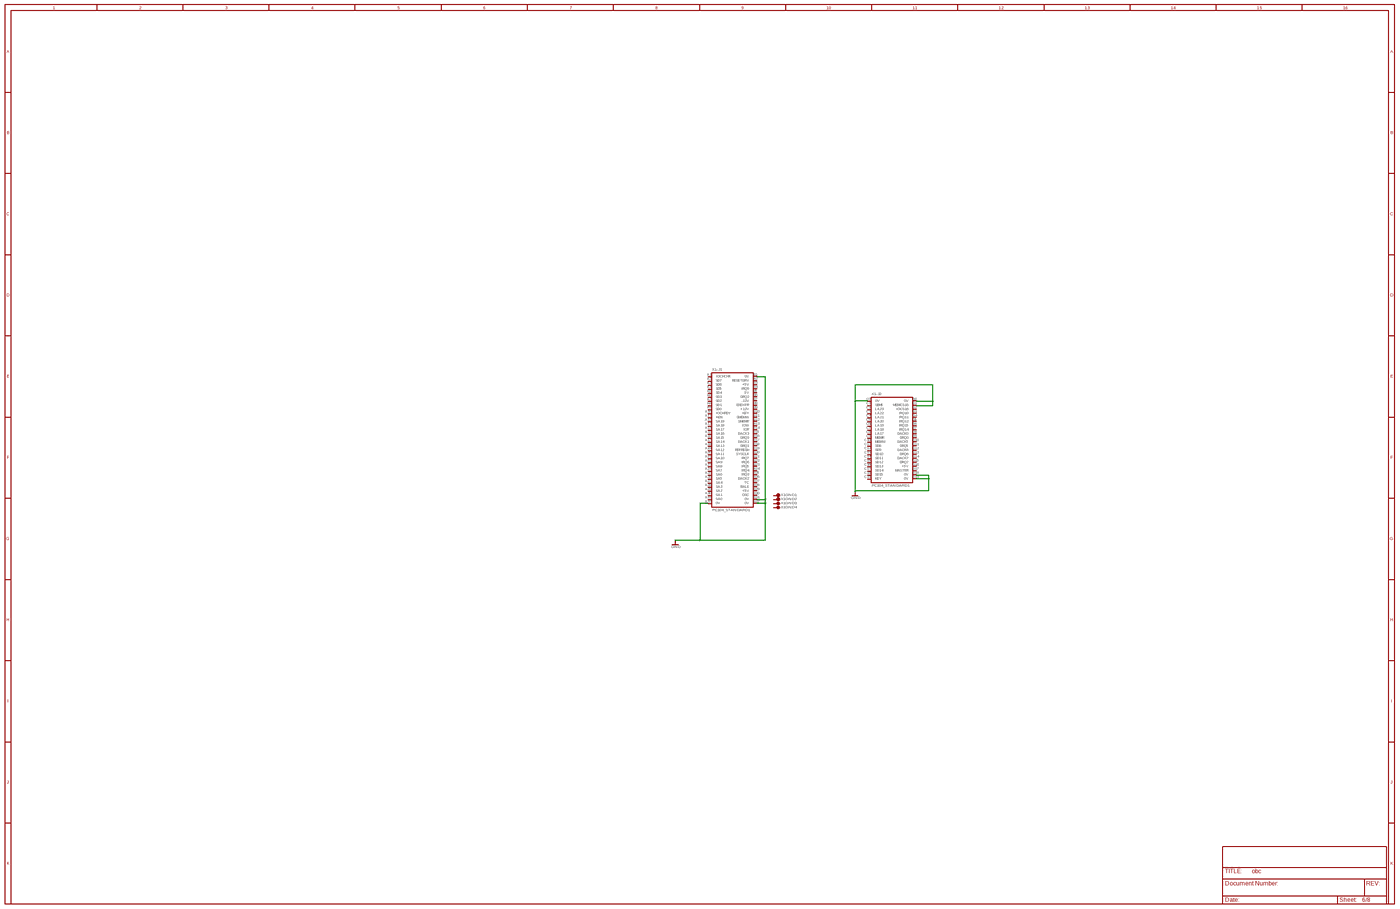
[diagram p14: schematic, sheet 6, overview]
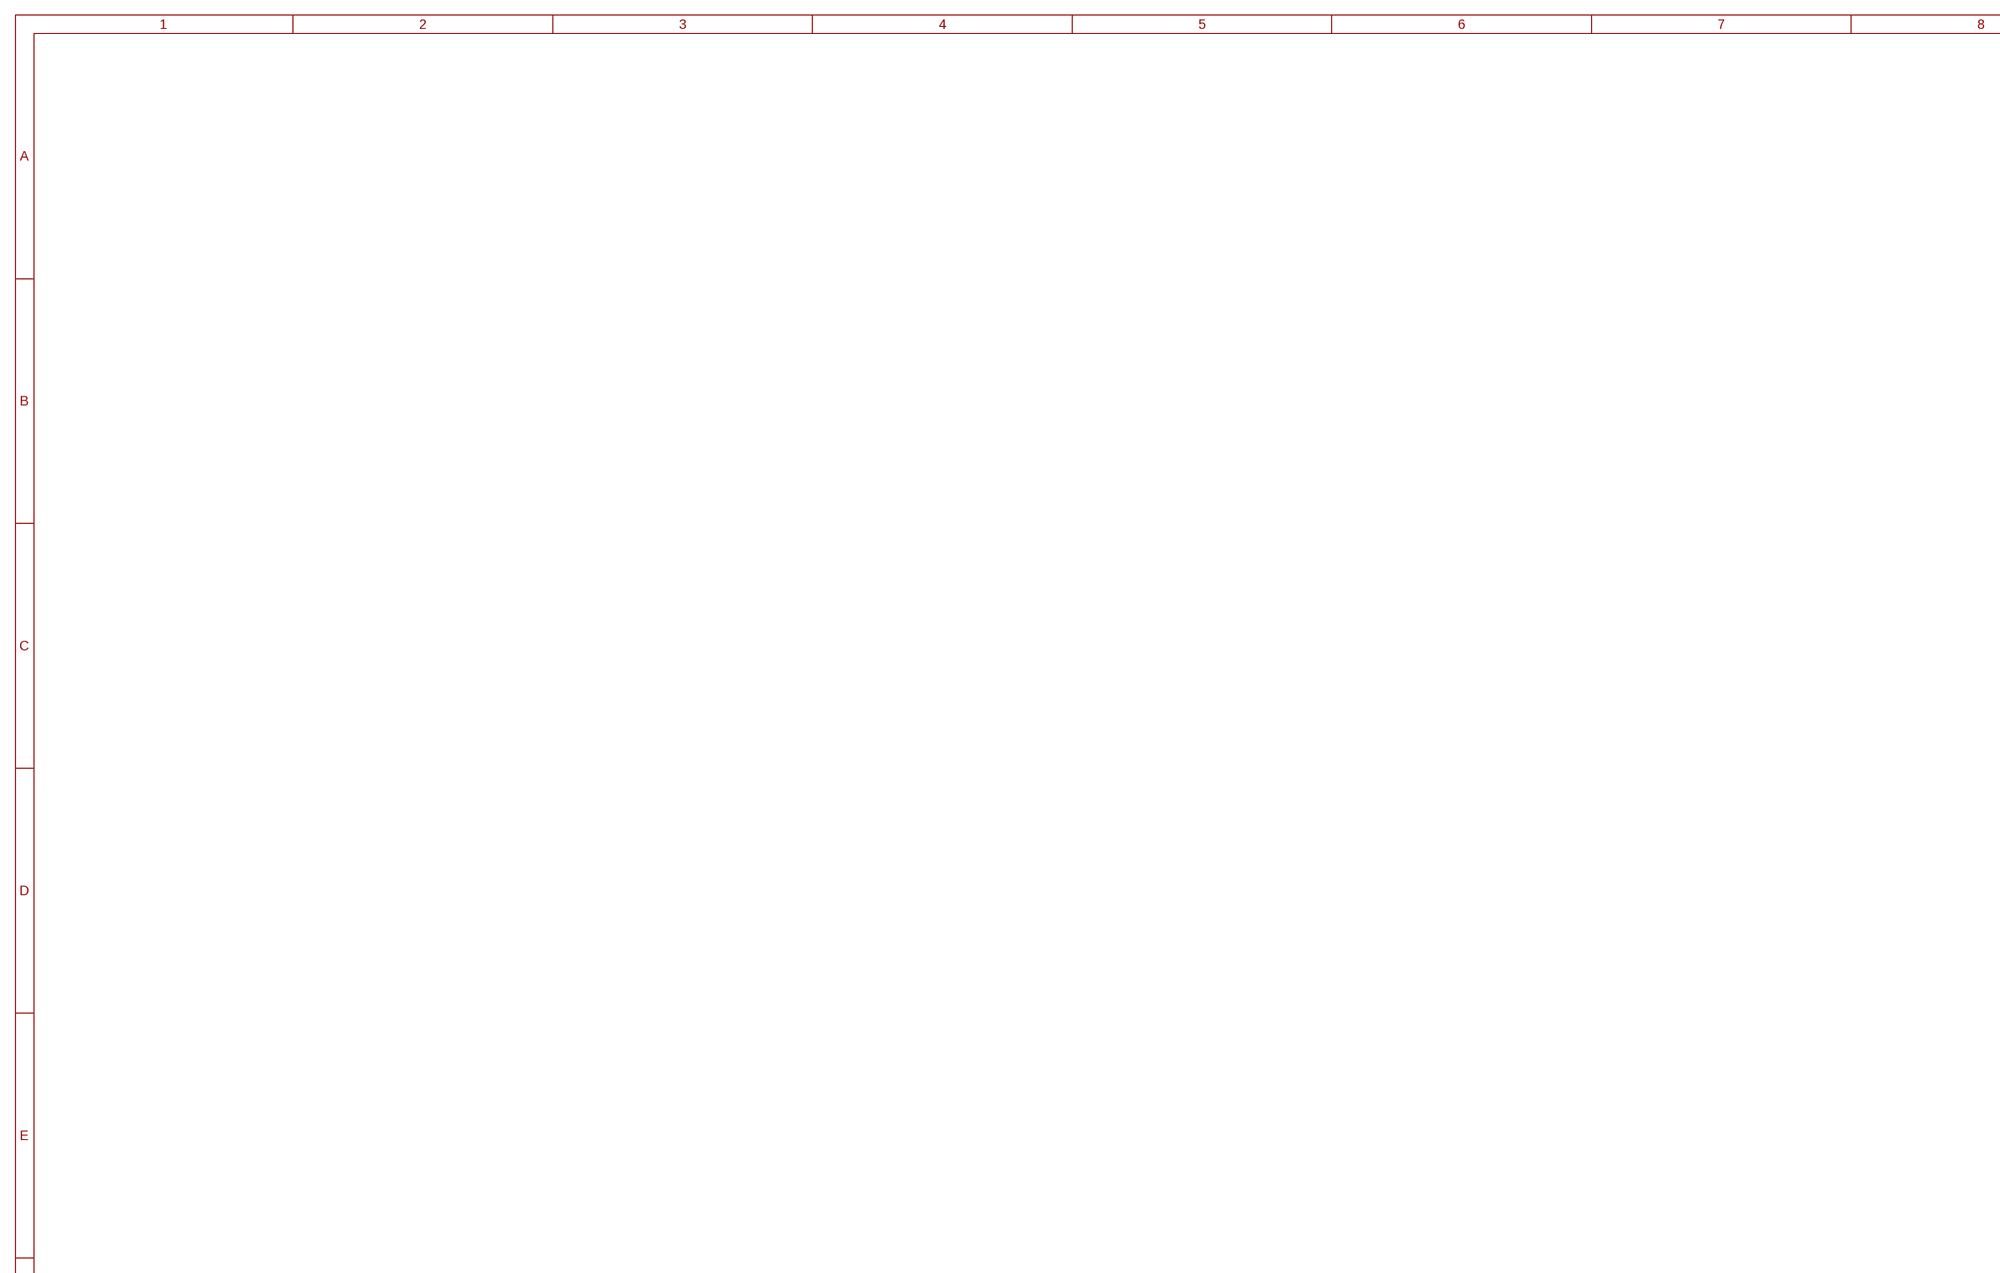
[diagram p15: schematic, sheet 6, part 1 of 4]
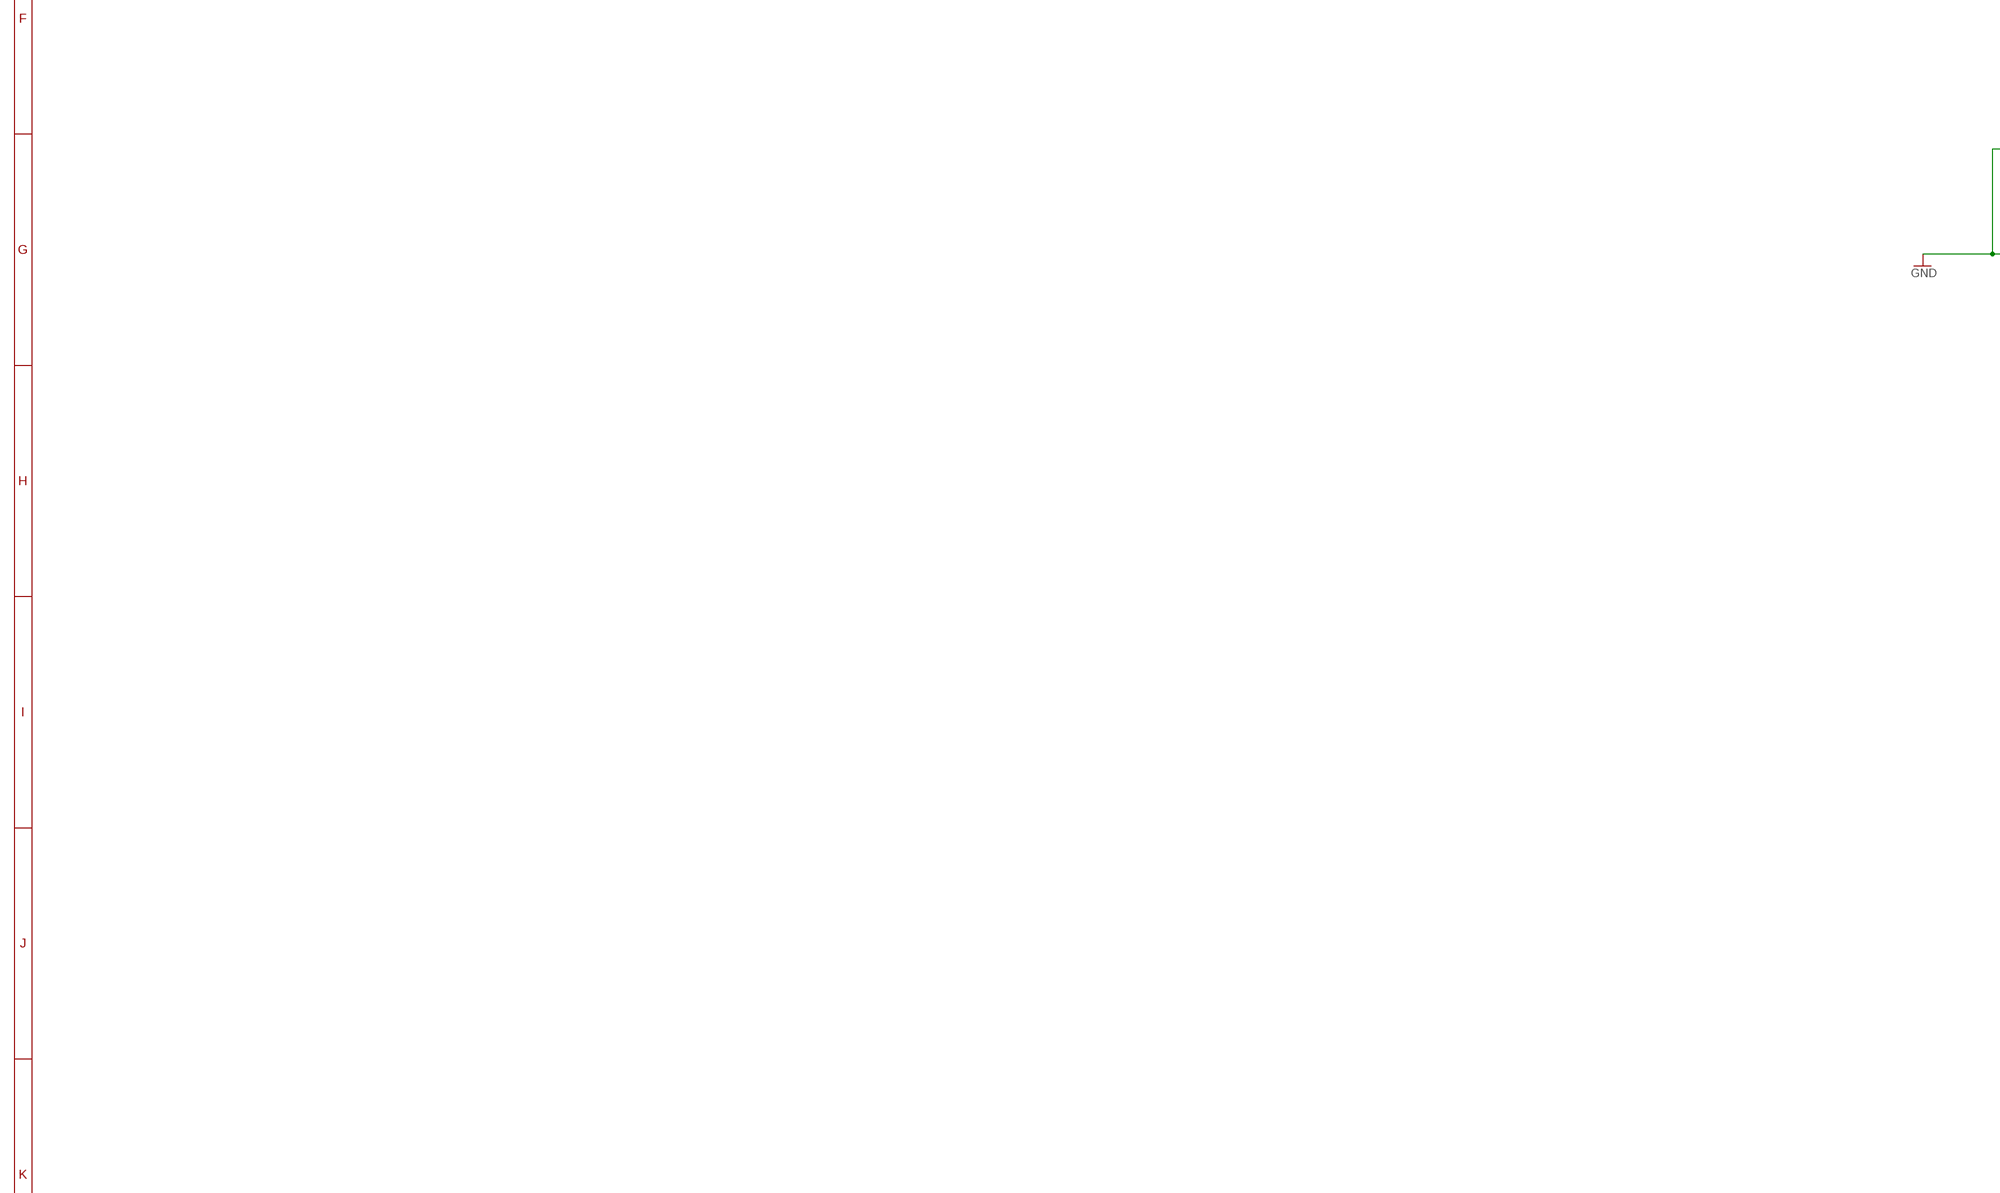
[diagram p16: schematic, sheet 6, part 2 of 4]
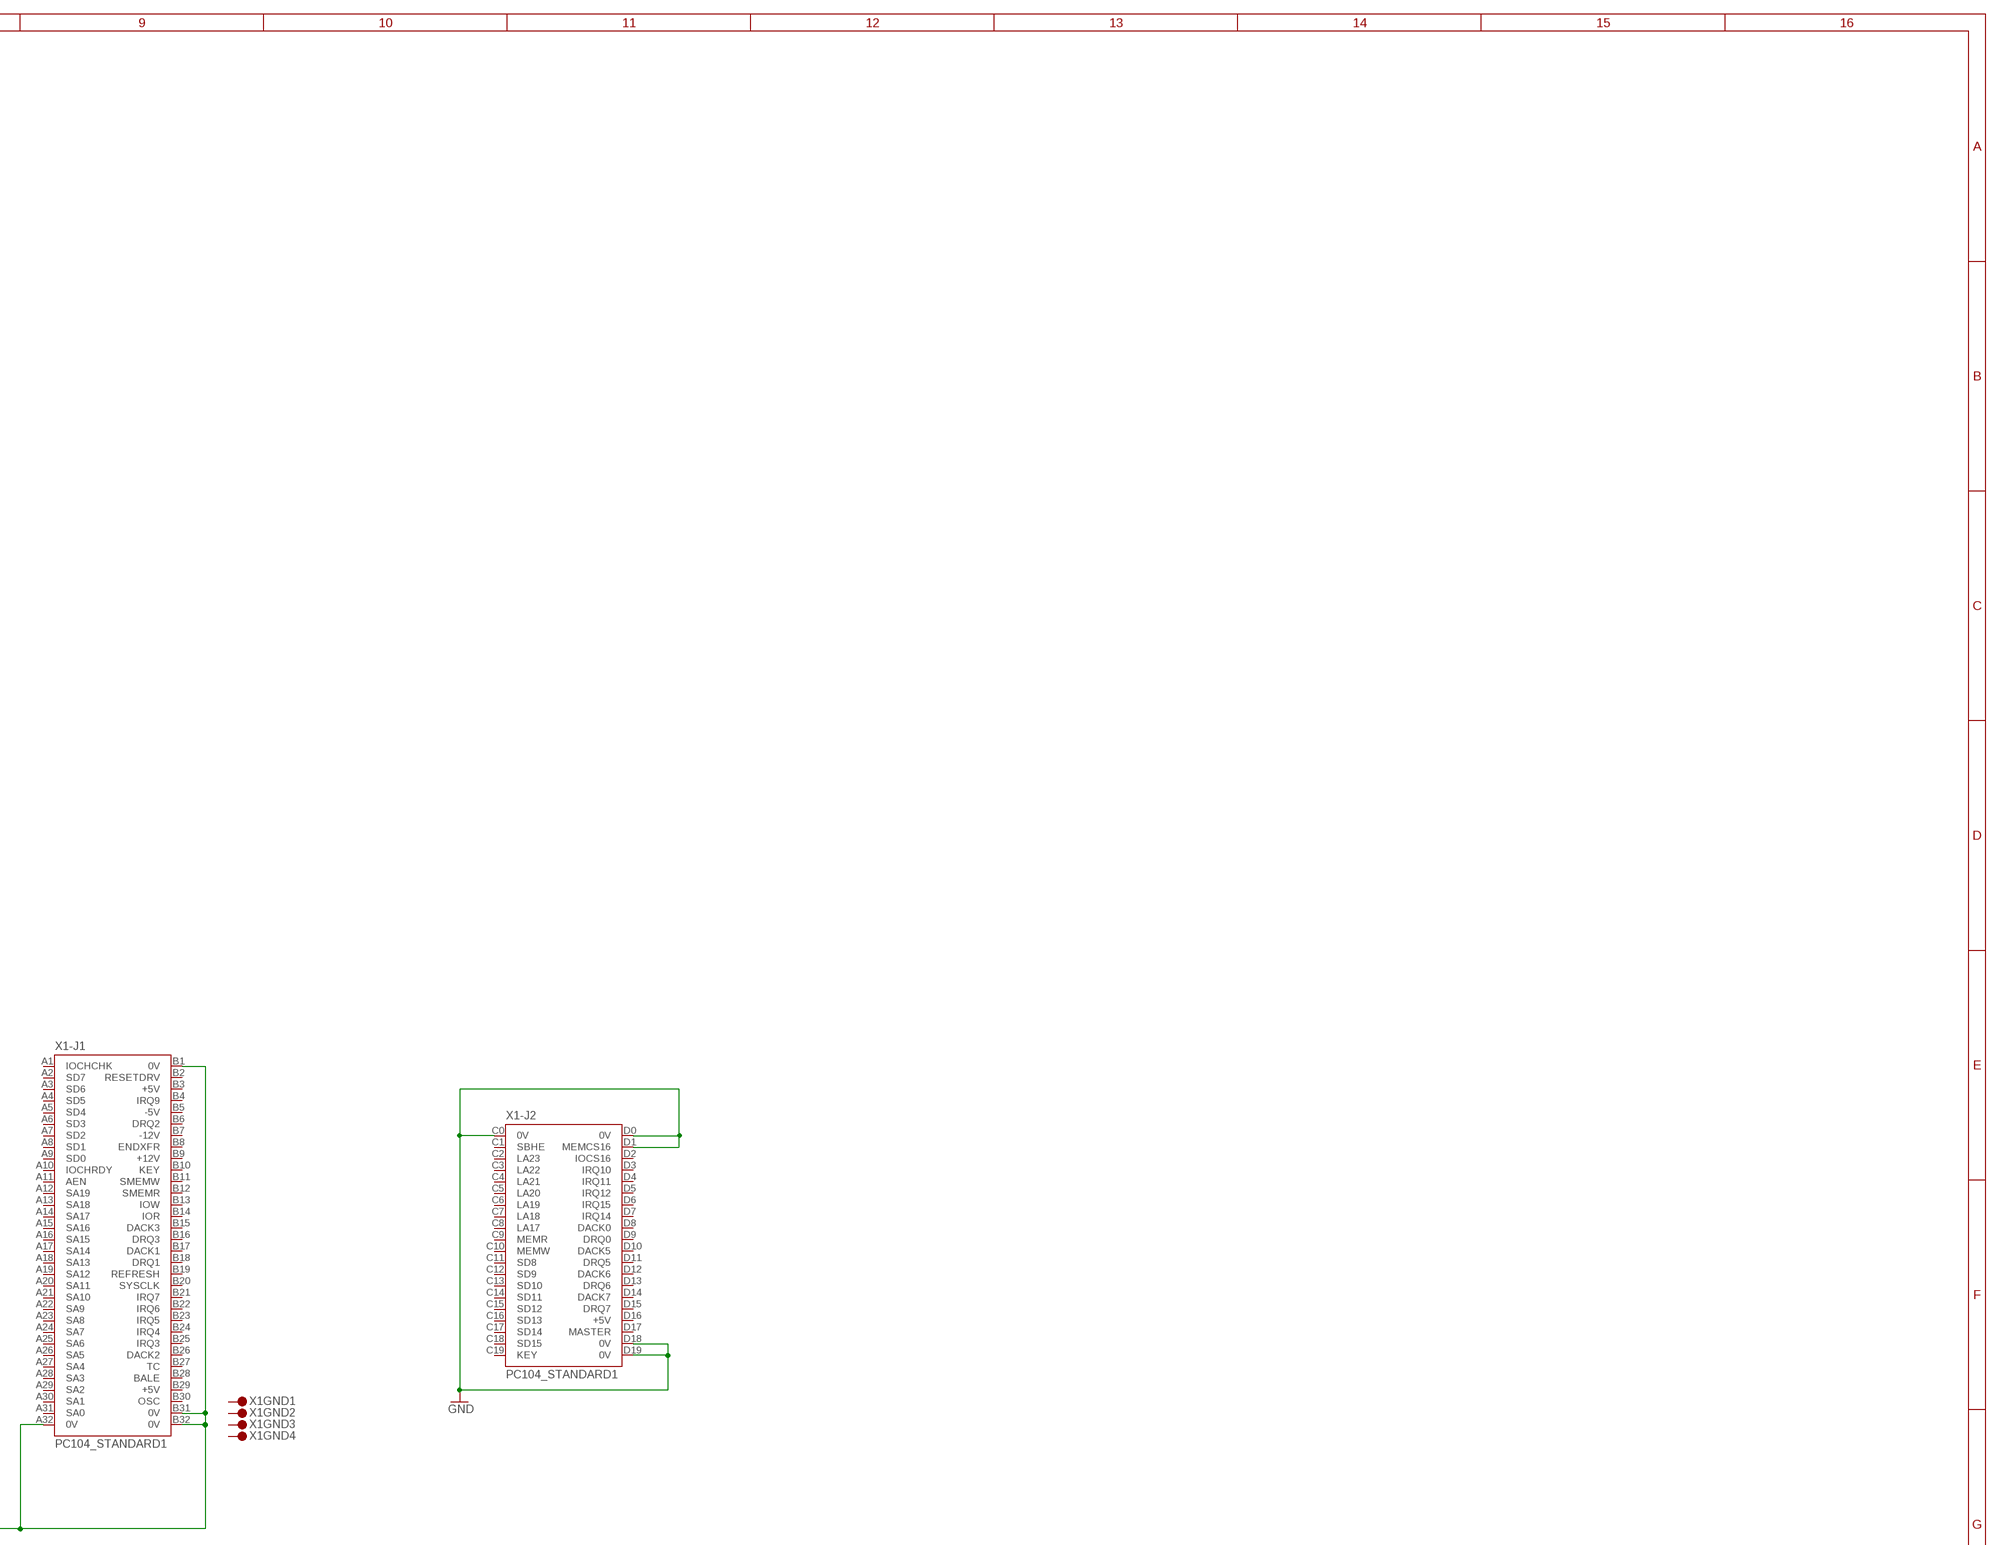
[diagram p17: schematic, sheet 6, part 3 of 4]
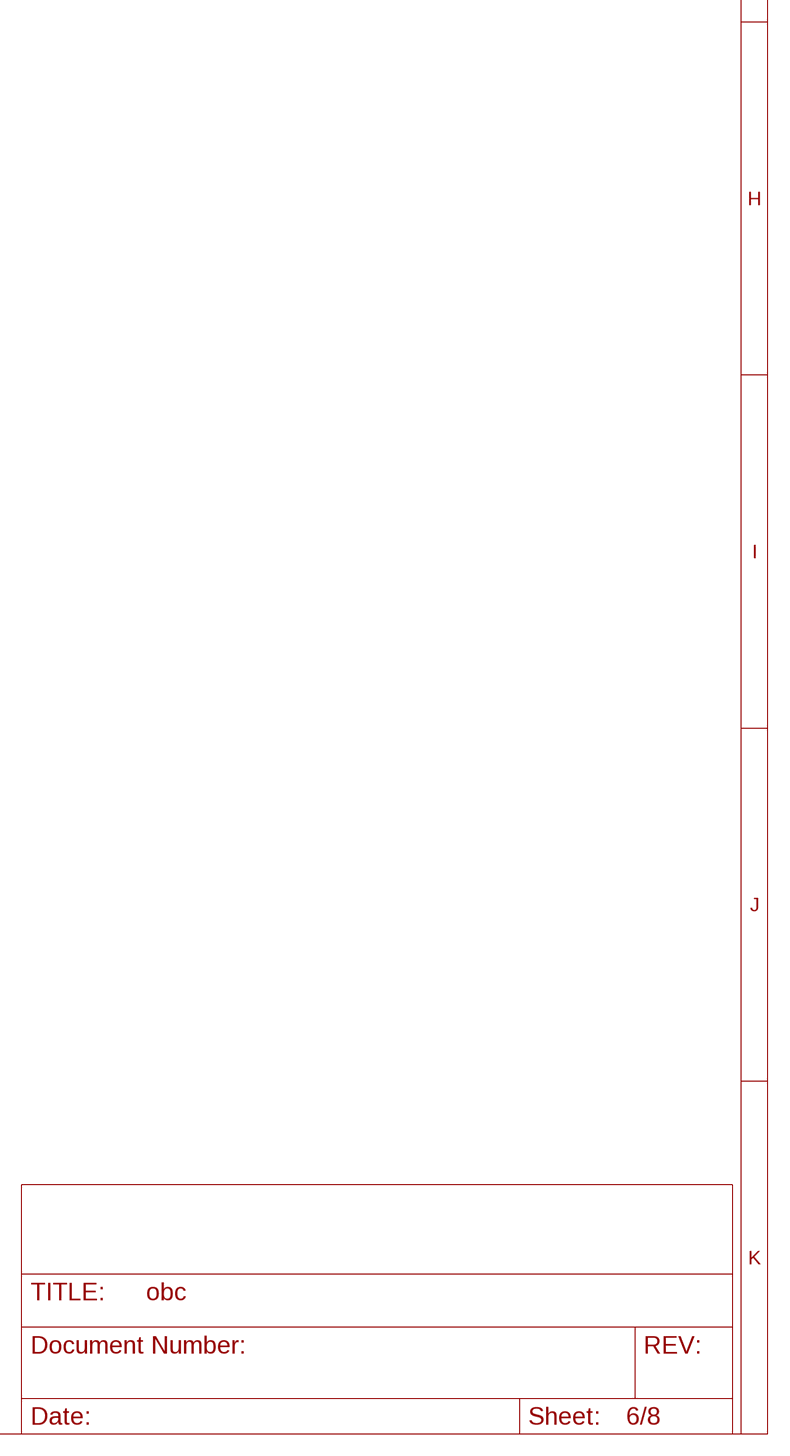
[diagram p18: schematic, sheet 6, part 4 of 4]

### Parts
X1  PC104_STANDARD1  [PC104-STANDARD]

### Nets
GND: X1.A32(-J1:0V) X1.B1(-J1:0V) X1.B31(-J1:0V) X1.B32(-J1:0V) X1.C0(-J2:0V) X1.D0(-J2:0V) X1.D1(-J2:MEMCS16) X1.D18(-J2:0V) X1.D19(-J2:0V) ; also sheet 1,2,3,4,5
Unconnected: X1.A1(-J1:IOCHCHK) X1.A2(-J1:SD7) X1.A3(-J1:SD6) X1.A4(-J1:SD5) X1.A5(-J1:SD4) X1.A6(-J1:SD3) X1.A7(-J1:SD2) X1.A8(-J1:SD1) X1.A9(-J1:SD0) X1.A10(-J1:IOCHRDY) X1.A11(-J1:AEN) X1.A12(-J1:SA19) X1.A13(-J1:SA18) X1.A14(-J1:SA17) X1.A15(-J1:SA16) X1.A16(-J1:SA15) X1.A17(-J1:SA14) X1.A18(-J1:SA13) X1.A19(-J1:SA12) X1.A20(-J1:SA11) X1.A21(-J1:SA10) X1.A22(-J1:SA9) X1.A23(-J1:SA8) X1.A24(-J1:SA7) X1.A25(-J1:SA6) X1.A26(-J1:SA5) X1.A27(-J1:SA4) X1.A28(-J1:SA3) X1.A29(-J1:SA2) X1.A30(-J1:SA1) X1.A31(-J1:SA0) X1.B2(-J1:RESETDRV) X1.B3(-J1:+5V) X1.B4(-J1:IRQ9) X1.B5(-J1:-5V) X1.B6(-J1:DRQ2) X1.B7(-J1:-12V) X1.B8(-J1:ENDXFR) X1.B9(-J1:+12V) X1.B10(-J1:KEY) X1.B11(-J1:SMEMW) X1.B12(-J1:SMEMR) X1.B13(-J1:IOW) X1.B14(-J1:IOR) X1.B15(-J1:DACK3) X1.B16(-J1:DRQ3) X1.B17(-J1:DACK1) X1.B18(-J1:DRQ1) X1.B19(-J1:REFRESH) X1.B20(-J1:SYSCLK) X1.B21(-J1:IRQ7) X1.B22(-J1:IRQ6) X1.B23(-J1:IRQ5) X1.B24(-J1:IRQ4) X1.B25(-J1:IRQ3) X1.B26(-J1:DACK2) X1.B27(-J1:TC) X1.B28(-J1:BALE) X1.B29(-J1:+5V) X1.B30(-J1:OSC) X1.C1(-J2:SBHE) X1.C2(-J2:LA23) X1.C3(-J2:LA22) X1.C4(-J2:LA21) X1.C5(-J2:LA20) X1.C6(-J2:LA19) X1.C7(-J2:LA18) X1.C8(-J2:LA17) X1.C9(-J2:MEMR) X1.C10(-J2:MEMW) X1.C11(-J2:SD8) X1.C12(-J2:SD9) X1.C13(-J2:SD10) X1.C14(-J2:SD11) X1.C15(-J2:SD12) X1.C16(-J2:SD13) X1.C17(-J2:SD14) X1.C18(-J2:SD15) X1.C19(-J2:KEY) X1.D2(-J2:IOCS16) X1.D3(-J2:IRQ10) X1.D4(-J2:IRQ11) X1.D5(-J2:IRQ12) X1.D6(-J2:IRQ15) X1.D7(-J2:IRQ14) X1.D8(-J2:DACK0) X1.D9(-J2:DRQ0) X1.D10(-J2:DACK5) X1.D11(-J2:DRQ5) X1.D12(-J2:DACK6) X1.D13(-J2:DRQ6) X1.D14(-J2:DACK7) X1.D15(-J2:DRQ7) X1.D16(-J2:+5V) X1.D17(-J2:MASTER) X1.GND@1 X1.GND@2 X1.GND@3 X1.GND@4

## Sheet 7 of 8: OpenSDA

## Sheet 8 of 8: Fuse Map

## Library data of the parts
C1-C64 = rcl:C-EU: CAPACITOR, European symbol; SPICEPREFIX: C
D1-D3 = diode:SCHOTTKY-DIODE: Schottky Diode
IC1 = SDRAM_and_HyperFlash:IS42S16160J-6BLI: DRAM 256M, 3.3V, SDRAM, 16Mx16, 166Mhz, 54 ball BGA (8mmx8mm) RoHS, IT Source: Datasheet <https://componentsearchengine.com/Datasheets/1/IS42S16160J-6BLI.pdf>; DESCRIPTION: DRAM 256M, 3.3V, SDRAM, 16Mx16, 166Mhz, 54 ball BGA (8mmx8mm) RoHS, IT; HEIGHT: 1.2mm; MANUFACTURER_NAME: Integrated Silicon Solution Inc.; MANUFACTURER_PART_NUMBER: IS42S16160J-6BLI; MOUSER_PART_NUMBER: 870-42S16160J6BLI; MOUSER_PRICE-STOCK: https://www.mouser.com/Search/Refine.aspx?Keyword=870-42S16160J6BLI
IC2 = SDRAM_and_HyperFlash:S26KS512SDPBHI020: 1.8V 512MBIT, HYPERFLASH, 166M Source: Datasheet <https://componentsearchengine.com/Datasheets/1/S26KS512SDPBHI020.pdf>; DESCRIPTION: 1.8V 512MBIT, HYPERFLASH, 166M; HEIGHT: 1mm; MANUFACTURER_NAME: Cypress Semiconductor; MANUFACTURER_PART_NUMBER: S26KS512SDPBHI020; MOUSER_PART_NUMBER: 727-26KS512SDPBHI020; MOUSER_PRICE-STOCK: https://www.mouser.com/Search/Refine.aspx?Keyword=727-26KS512SDPBHI020
J1 = DX4R205JJAR1800:DX4R205JJAR1800: CONN RCPT MICRO USB 2.0 AB; DESCRIPTION: DX4 series, receptacle, on-board, right-angle standard mount, surface mount; DIGI-KEY_PART_NUMBER: 670-2677-1-ND; DIGI-KEY_PURCHASE_URL: https://www.digikey.com/product-detail/en/jae-electronics/DX4R205JJAR1800/670-2677-1-ND/3903237?utm_source=snapeda&utm_medium=aggregator&utm_campaign=symbol; MF: JAE Electronics; MP: DX4R205JJAR1800; PACKAGE: None
JP1 = pinhead:PINHD-2X10: PIN HEADER
L1 = inductors:BLM15H: EMIFIL (R) Chip Ferrite Bead for GHz Noise Source: http://www.murata.com/ Ferrite Bead BLM15H.pdf
L2 = rcl:L-EU: INDUCTOR, European symbol; SPICEPREFIX: L
L3 L4 = inductors:B82132: INDUCTOR; SPICEPREFIX: L
Q1 = crystal:FA-: MHz RANGE CRYSTAL UNIT Source: Epson Toyocom
Q2 = transistor-fet:BUZ72: N-Channel Enhancement MOSFET 100V; 10A; 0,2Ohm
Q3 = crystal:FC-12M: kHz RANGE CRYSTAL UNIT LOW PROFILE SMD Source: Epson Toyocom FC-12M.pdf
R1-R27 R36-R63 R66-R73 = rcl:R-EU_: RESISTOR, European symbol; SPICEPREFIX: R
R28-R35 = ngspice-simulation:R: RESISTOR
TP1-TP6 = testpad:TP: Test pad
TR1 = inductor-neosid:SM-T4: TRANSFORMER SMD wideband transformer; OC_FARNELL: unknown; OC_NEWARK: unknown
U1 = MIMXRT1052DVL6A:MIMXRT1052DVL6A: MIMXRT1052: 3.3 V 600 MHz ARM® Cortex®-M7 Microprocessor IC; DESCRIPTION: MIMXRT1052: 3.3 V 600 MHz ARM® Cortex®-M7 Microprocessor IC; DIGI-KEY_PART_NUMBER: 568-13515-ND; DIGI-KEY_PURCHASE_URL: https://www.digikey.com/product-detail/en/nxp-usa-inc/MIMXRT1052DVL6A/568-13515-ND/7646297?utm_source=snapeda&utm_medium=aggregator&utm_campaign=symbol; MF: NXP USA; MP: MIMXRT1052DVL6A; PACKAGE: LFBGA-196 NXP Semiconductors
U2 = NX5P3090UKZ:NX5P3090UKZ: USB Power SW Single 2.5V to 5.5V 0.4A to 3.3A 12-Pin WLCSP; DESCRIPTION: USB Power SW Single 2.5V to 5.5V 0.4A to 3.3A 12-Pin WLCSP; DIGI-KEY_PART_NUMBER: 568-13049-1-ND; DIGI-KEY_PURCHASE_URL: https://www.digikey.com/product-detail/en/nxp-usa-inc/NX5P3090UKZ/568-13049-1-ND/6173637?utm_source=snapeda&utm_medium=aggregator&utm_campaign=symbol; MF: NXP USA; MP: NX5P3090UKZ; PACKAGE: UFBGA-12 NXP Semiconductors
U3 = RCLAMP0854P.TCT:RCLAMP0854P.TCT: Diode TVS Dual Uni-Dir 5.5V 200W 6-Pin SLP EP T/R; DESCRIPTION: Diode TVS Dual Uni-Dir 5.5V 200W 6-Pin SLP EP T/R; DIGI-KEY_PART_NUMBER: RCLAMP0854P.TCTCT-ND; DIGI-KEY_PURCHASE_URL: https://www.digikey.com/product-detail/en/semtech-corporation/RCLAMP0854P.TCT/RCLAMP0854P.TCTCT-ND/5113720?utm_source=snapeda&utm_medium=aggregator&utm_campaign=symbol; MF: Semtech; MP: RCLAMP0854P.TCT; PACKAGE: UFDFN-6 Semtech
X1 = con-pc104:PC104_STANDARD: PC/104 Standard 16 bit